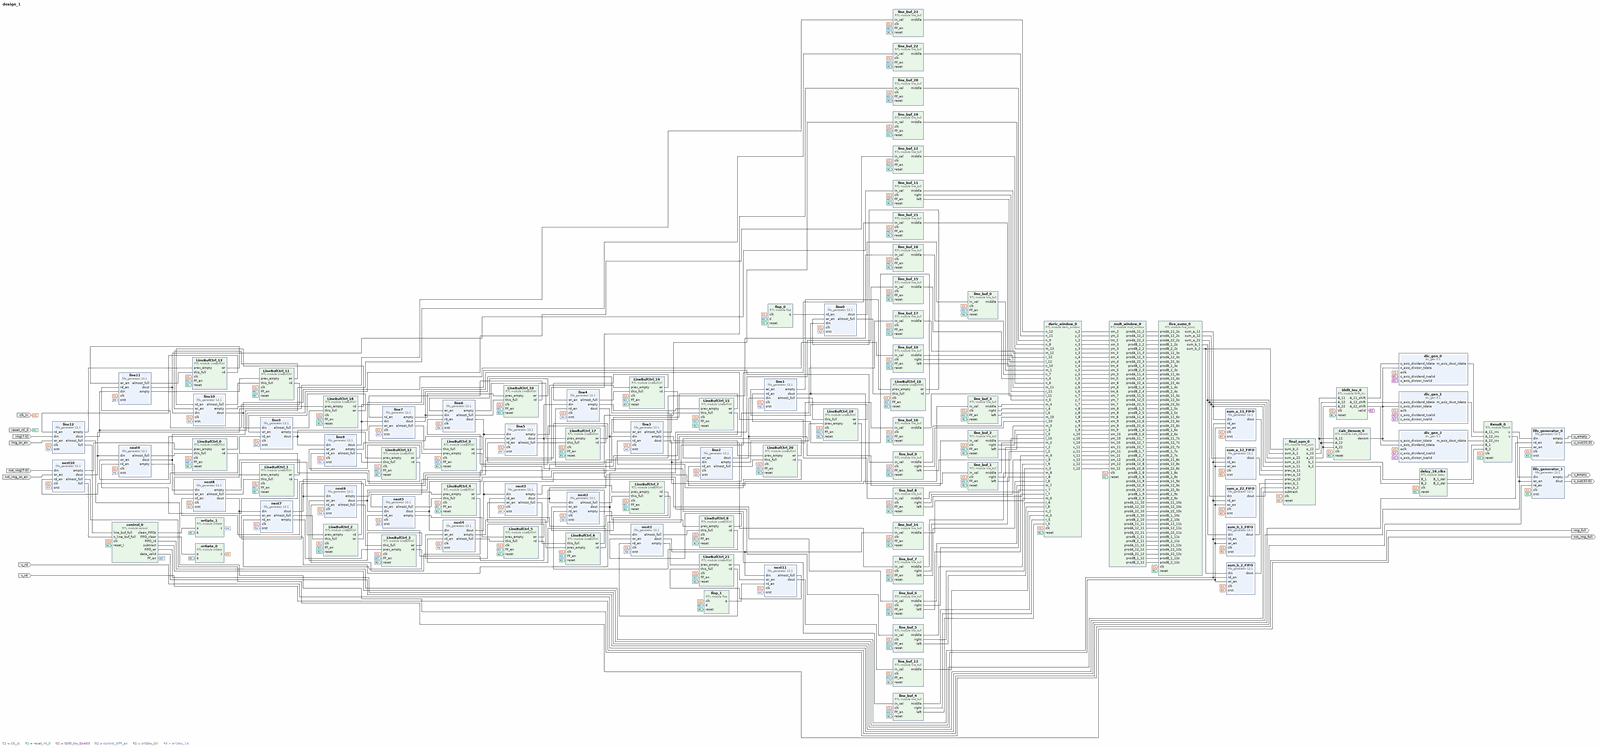
[diagram p0: block diagram of the top level, whole]
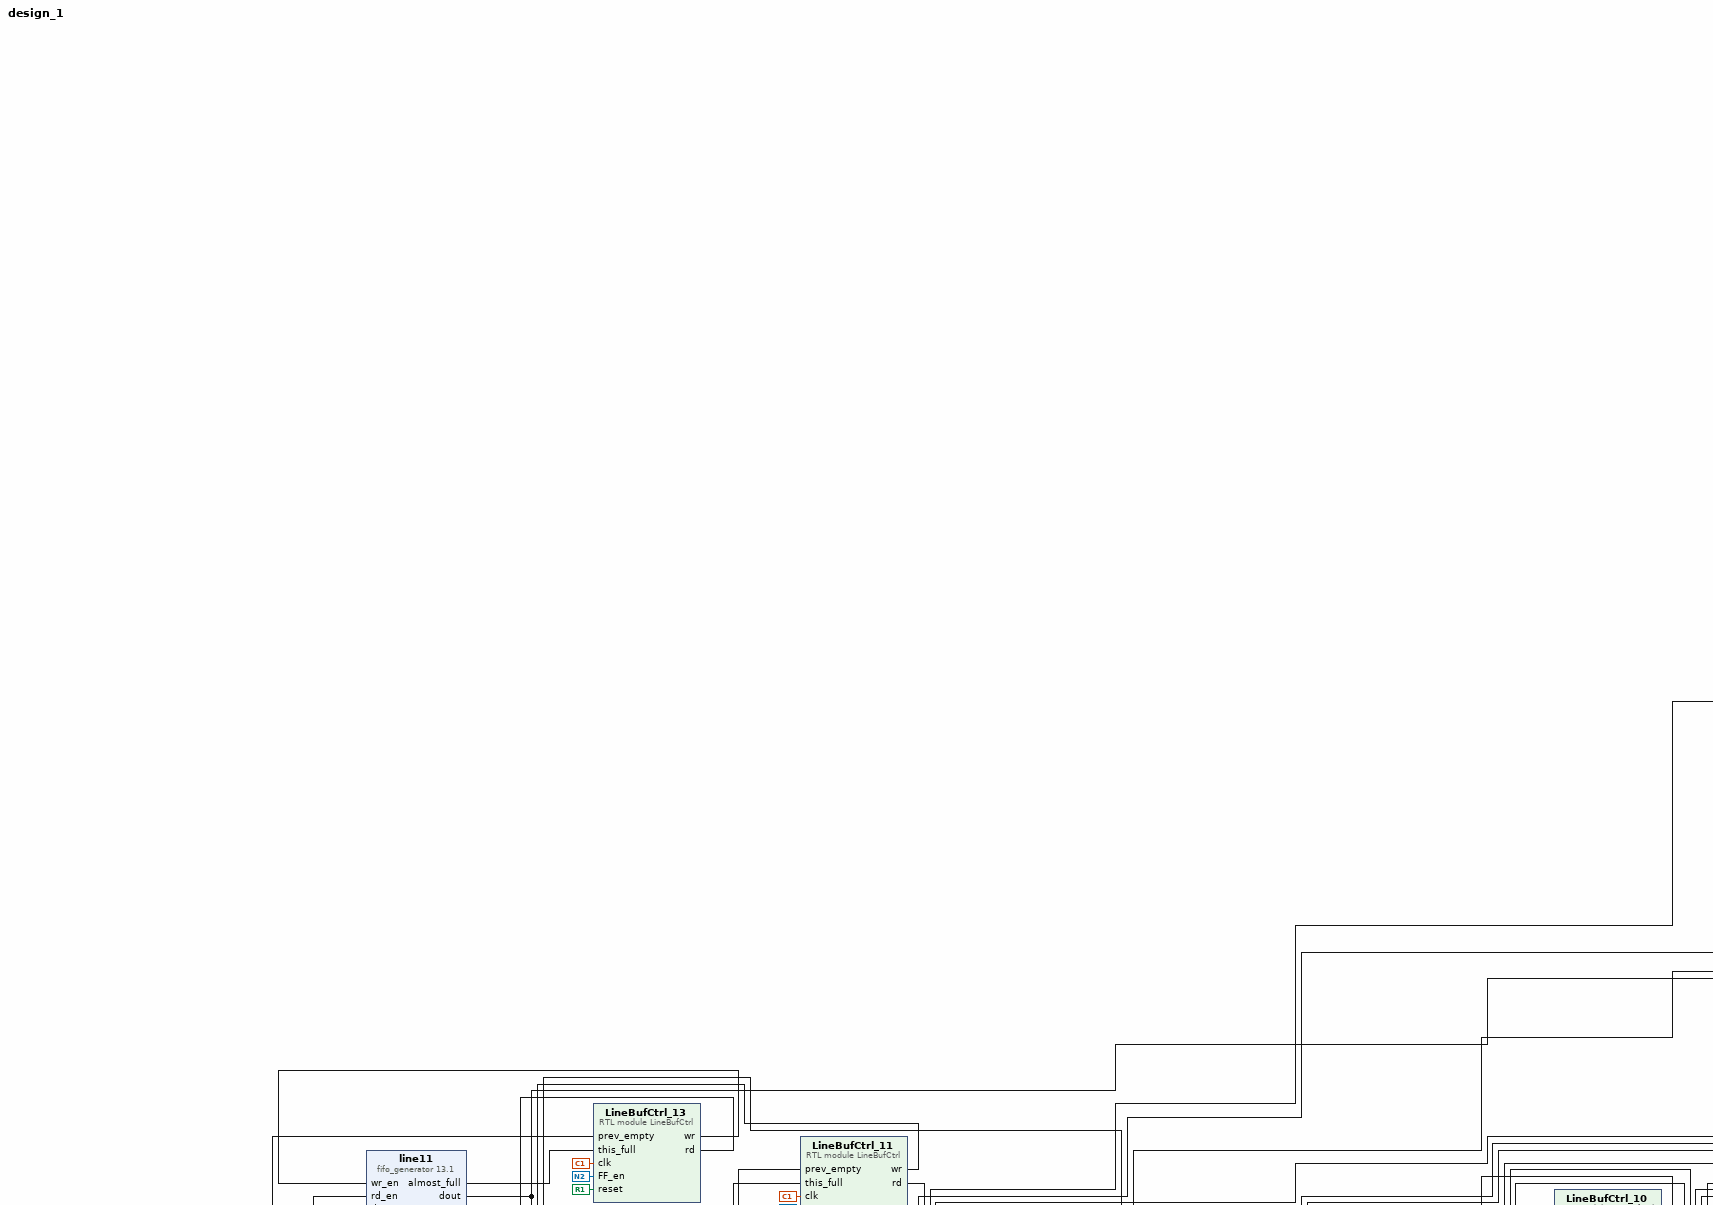
[diagram p1: block diagram of the top level, upper left part]
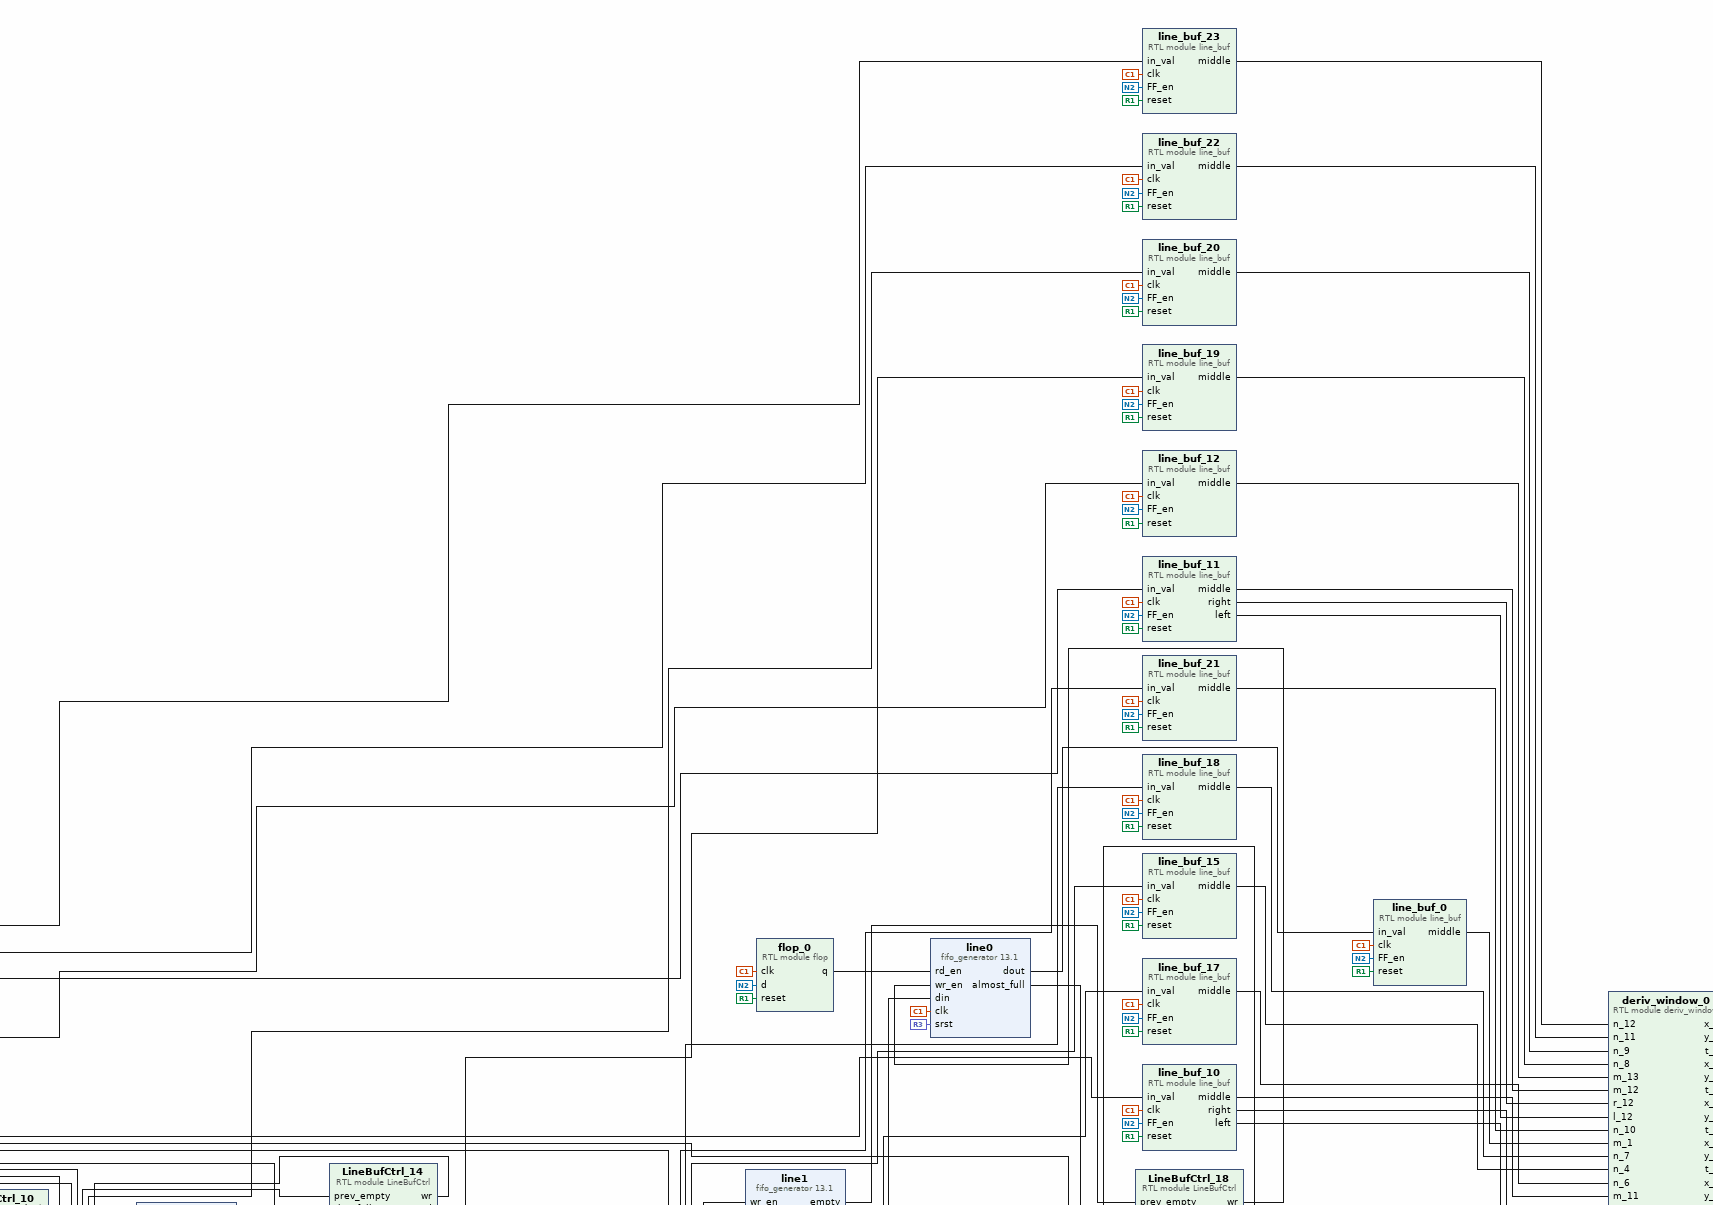
[diagram p2: block diagram of the top level, upper centre part]
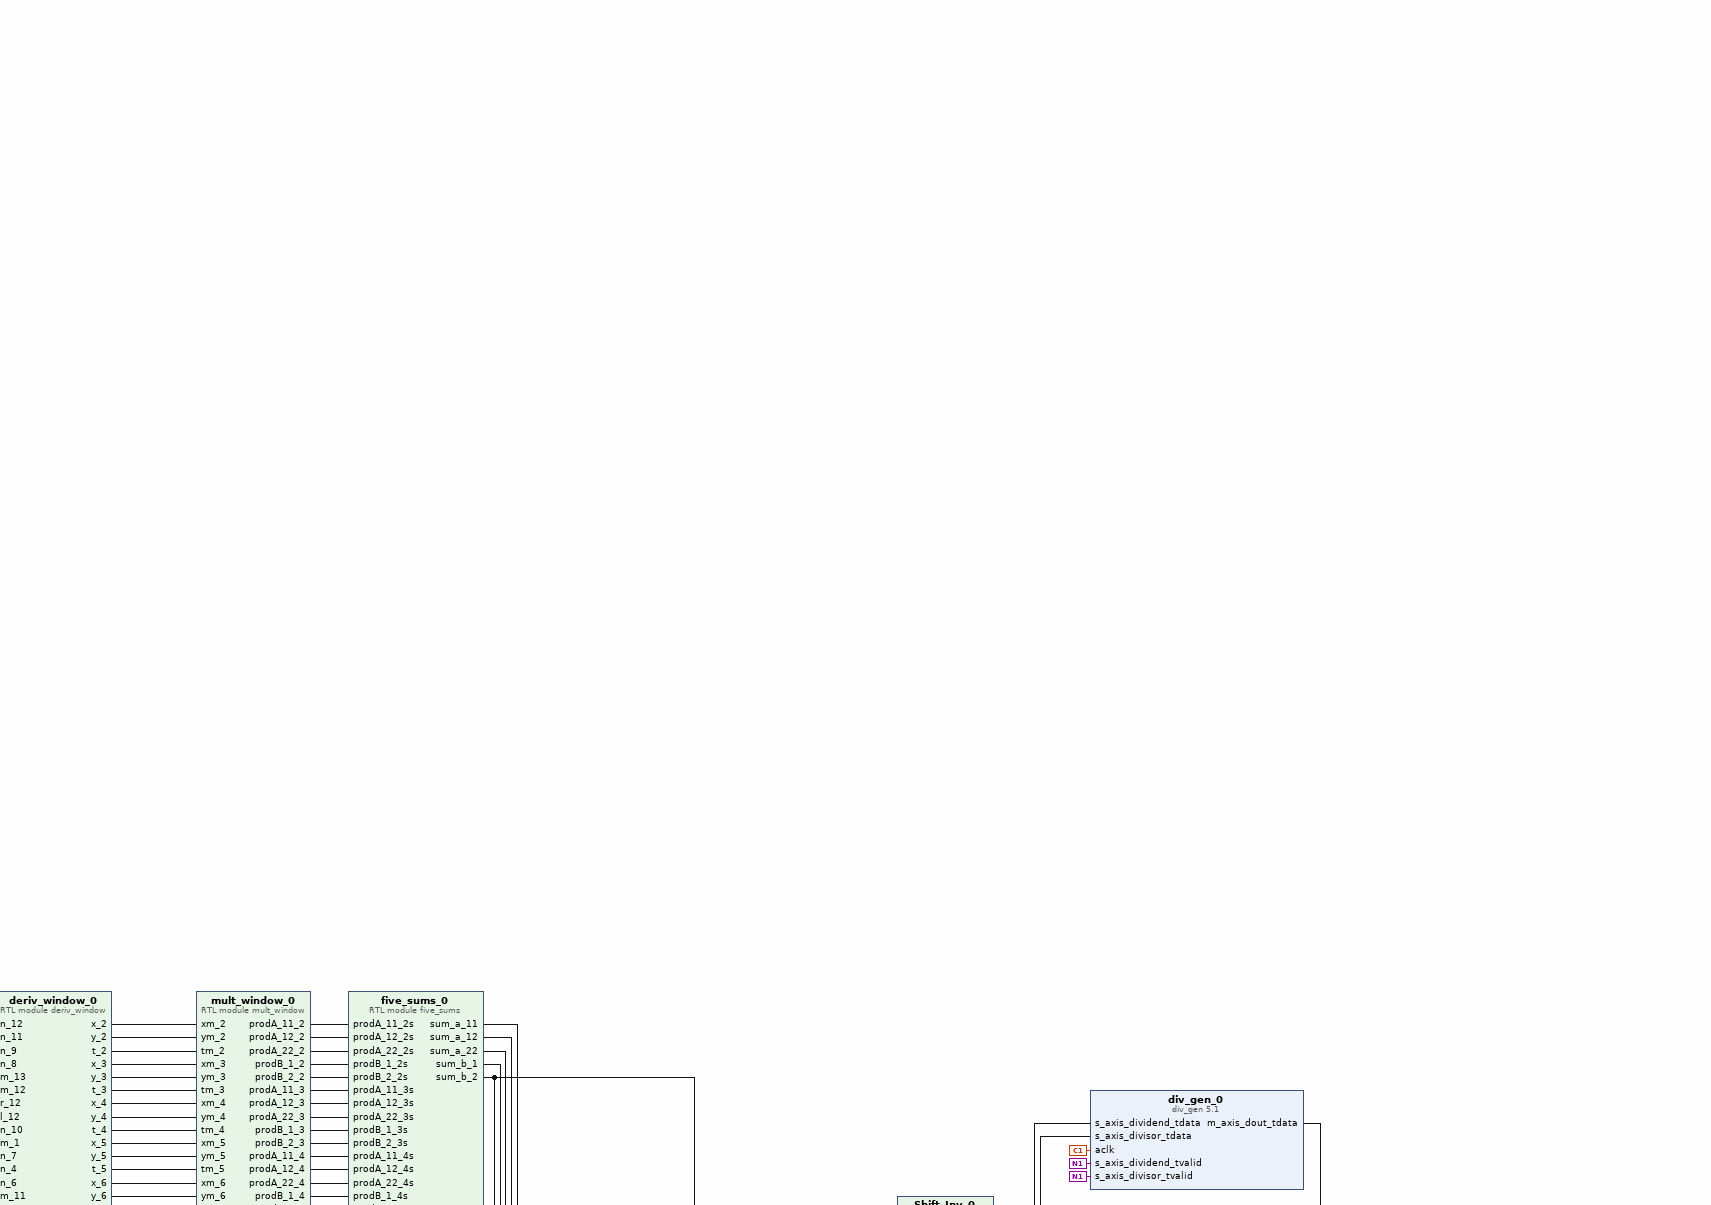
[diagram p3: block diagram of the top level, upper right part]
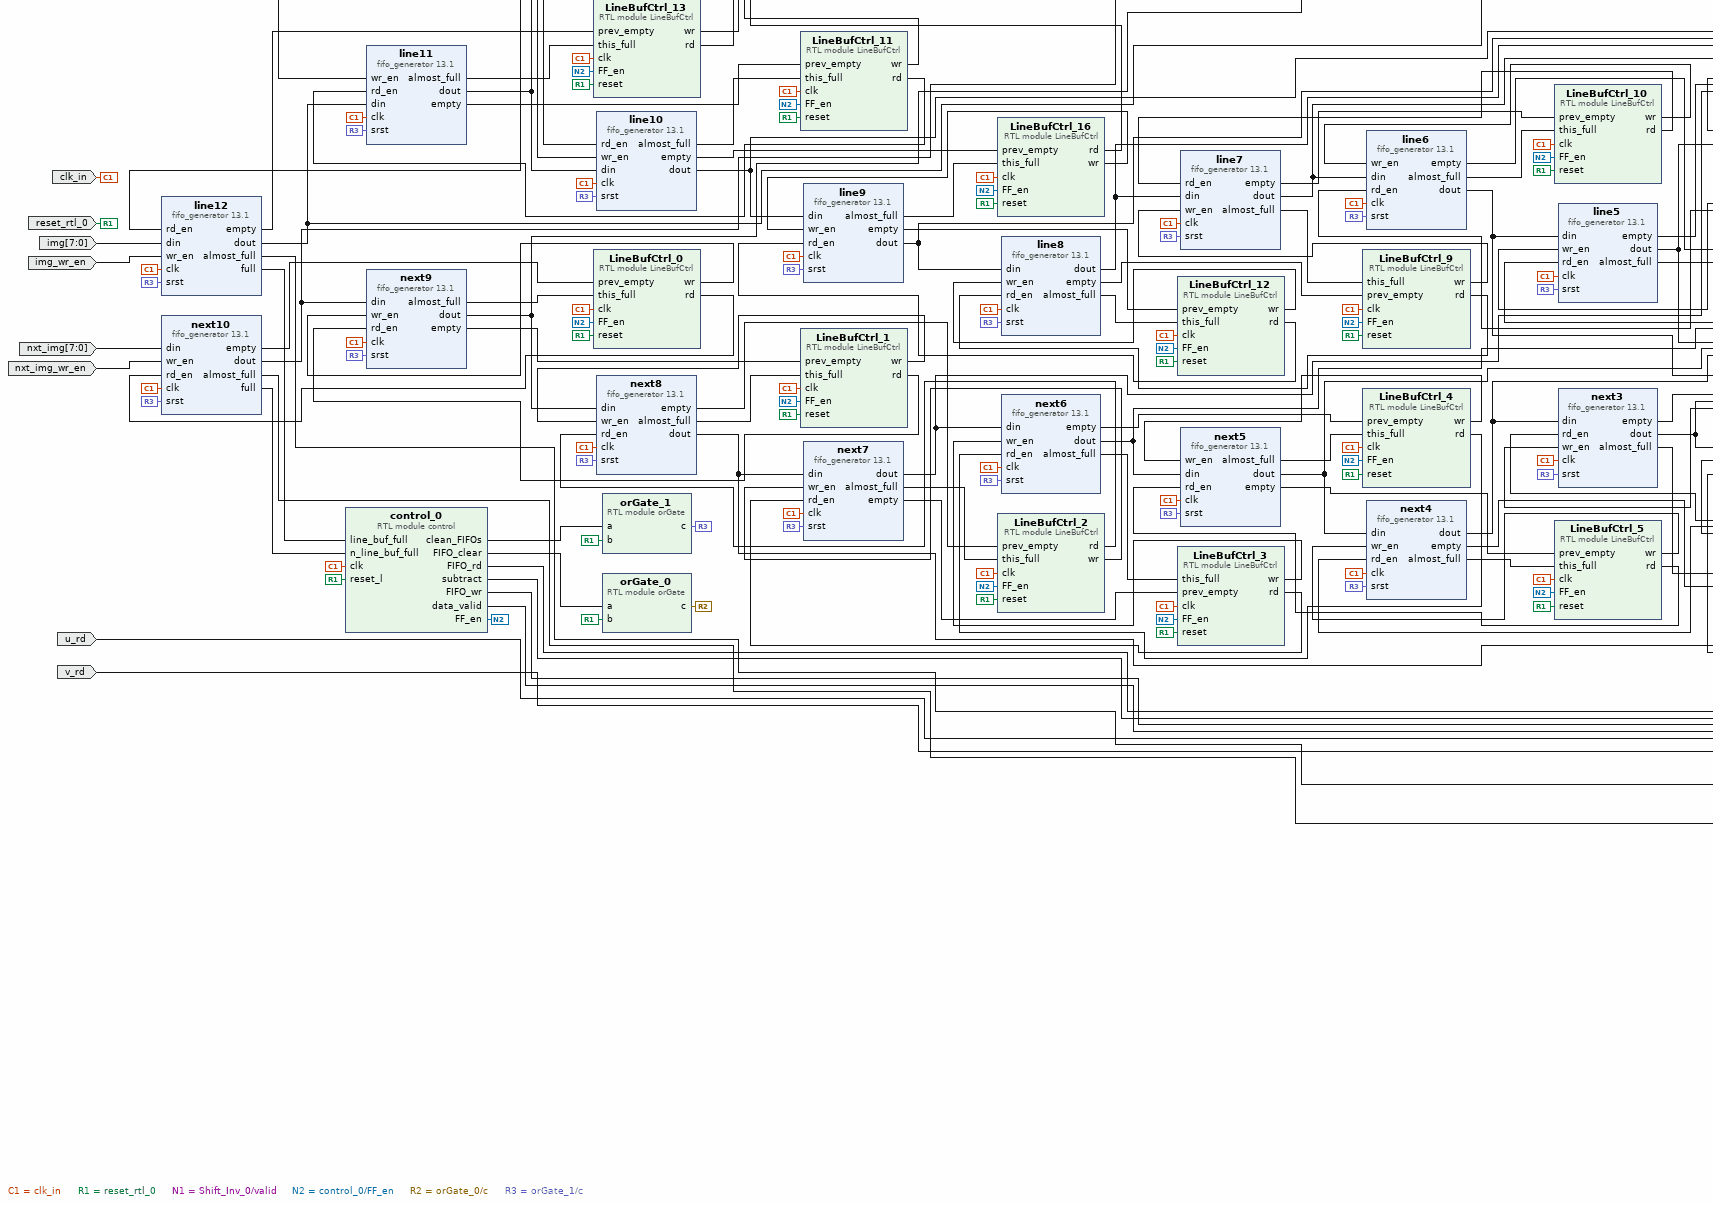
[diagram p4: block diagram of the top level, lower left part]
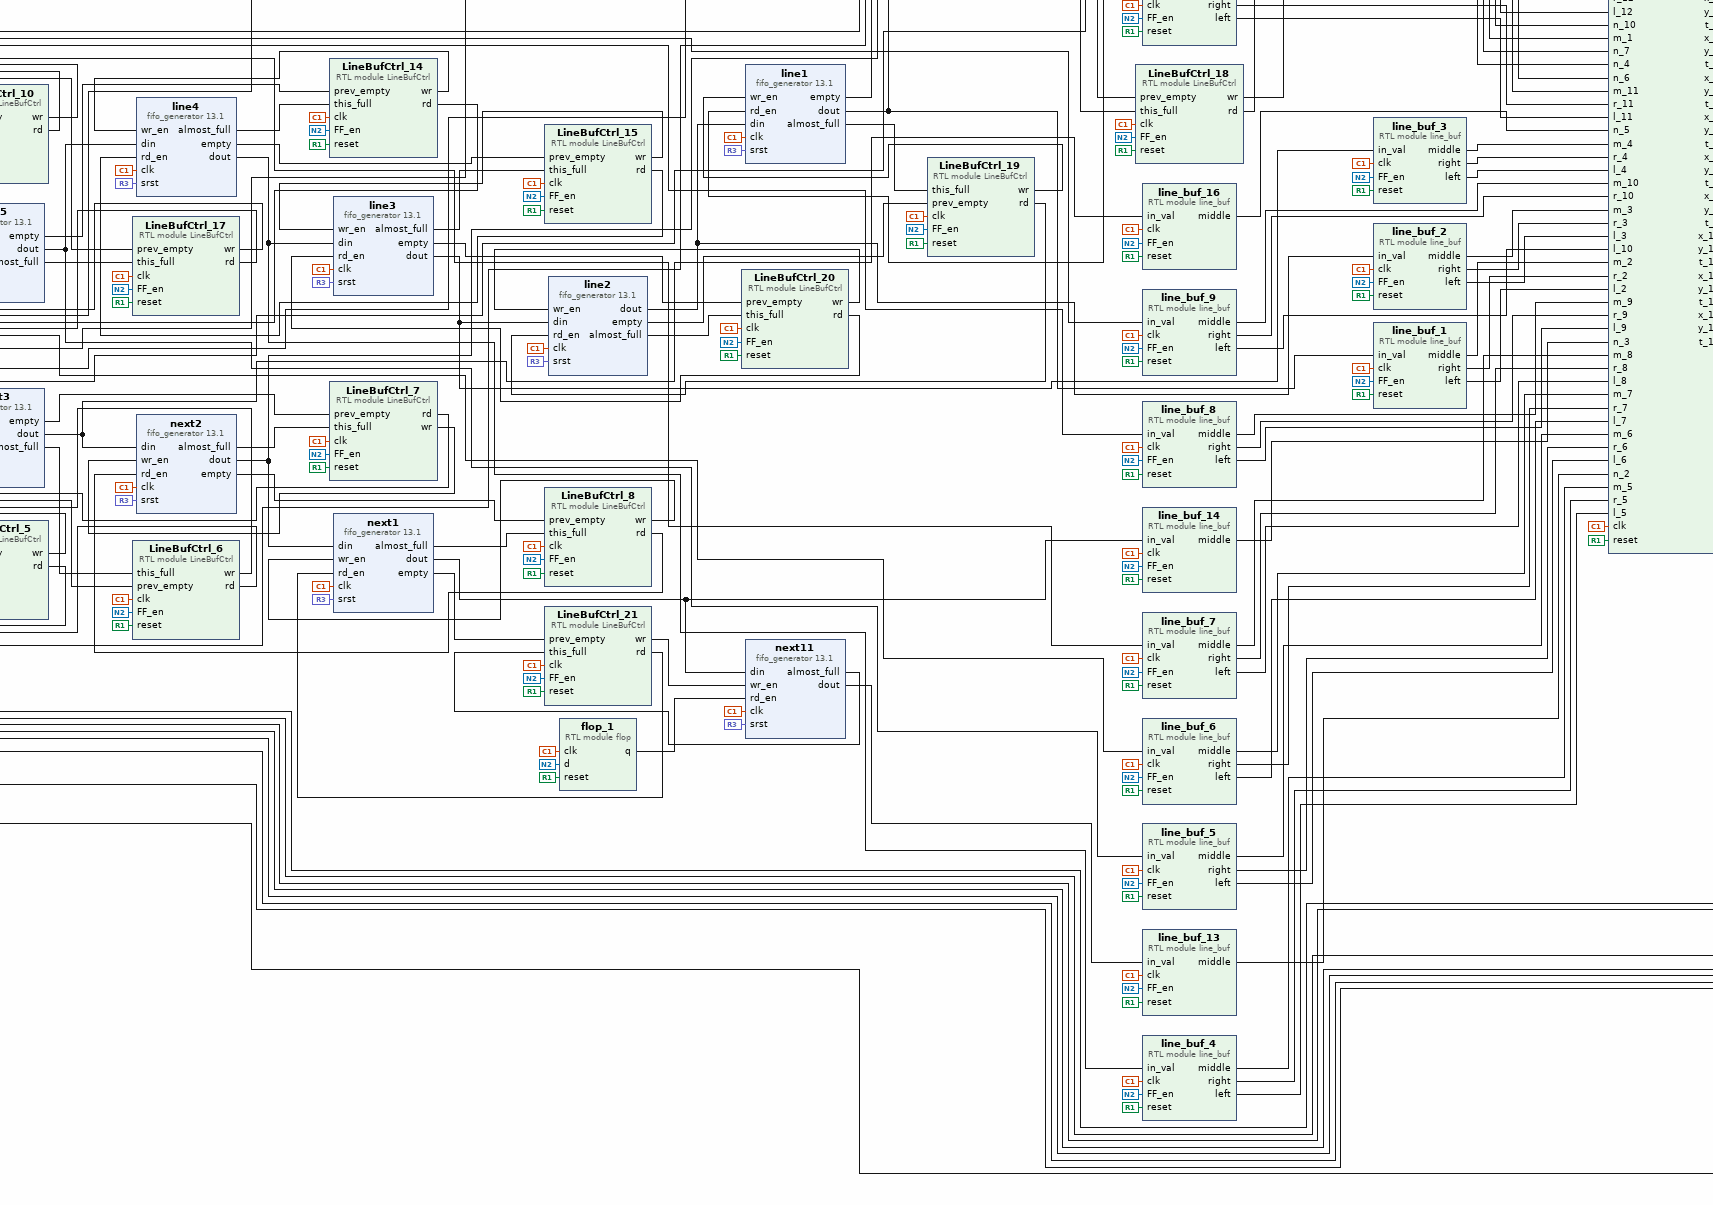
[diagram p5: block diagram of the top level, lower centre part]
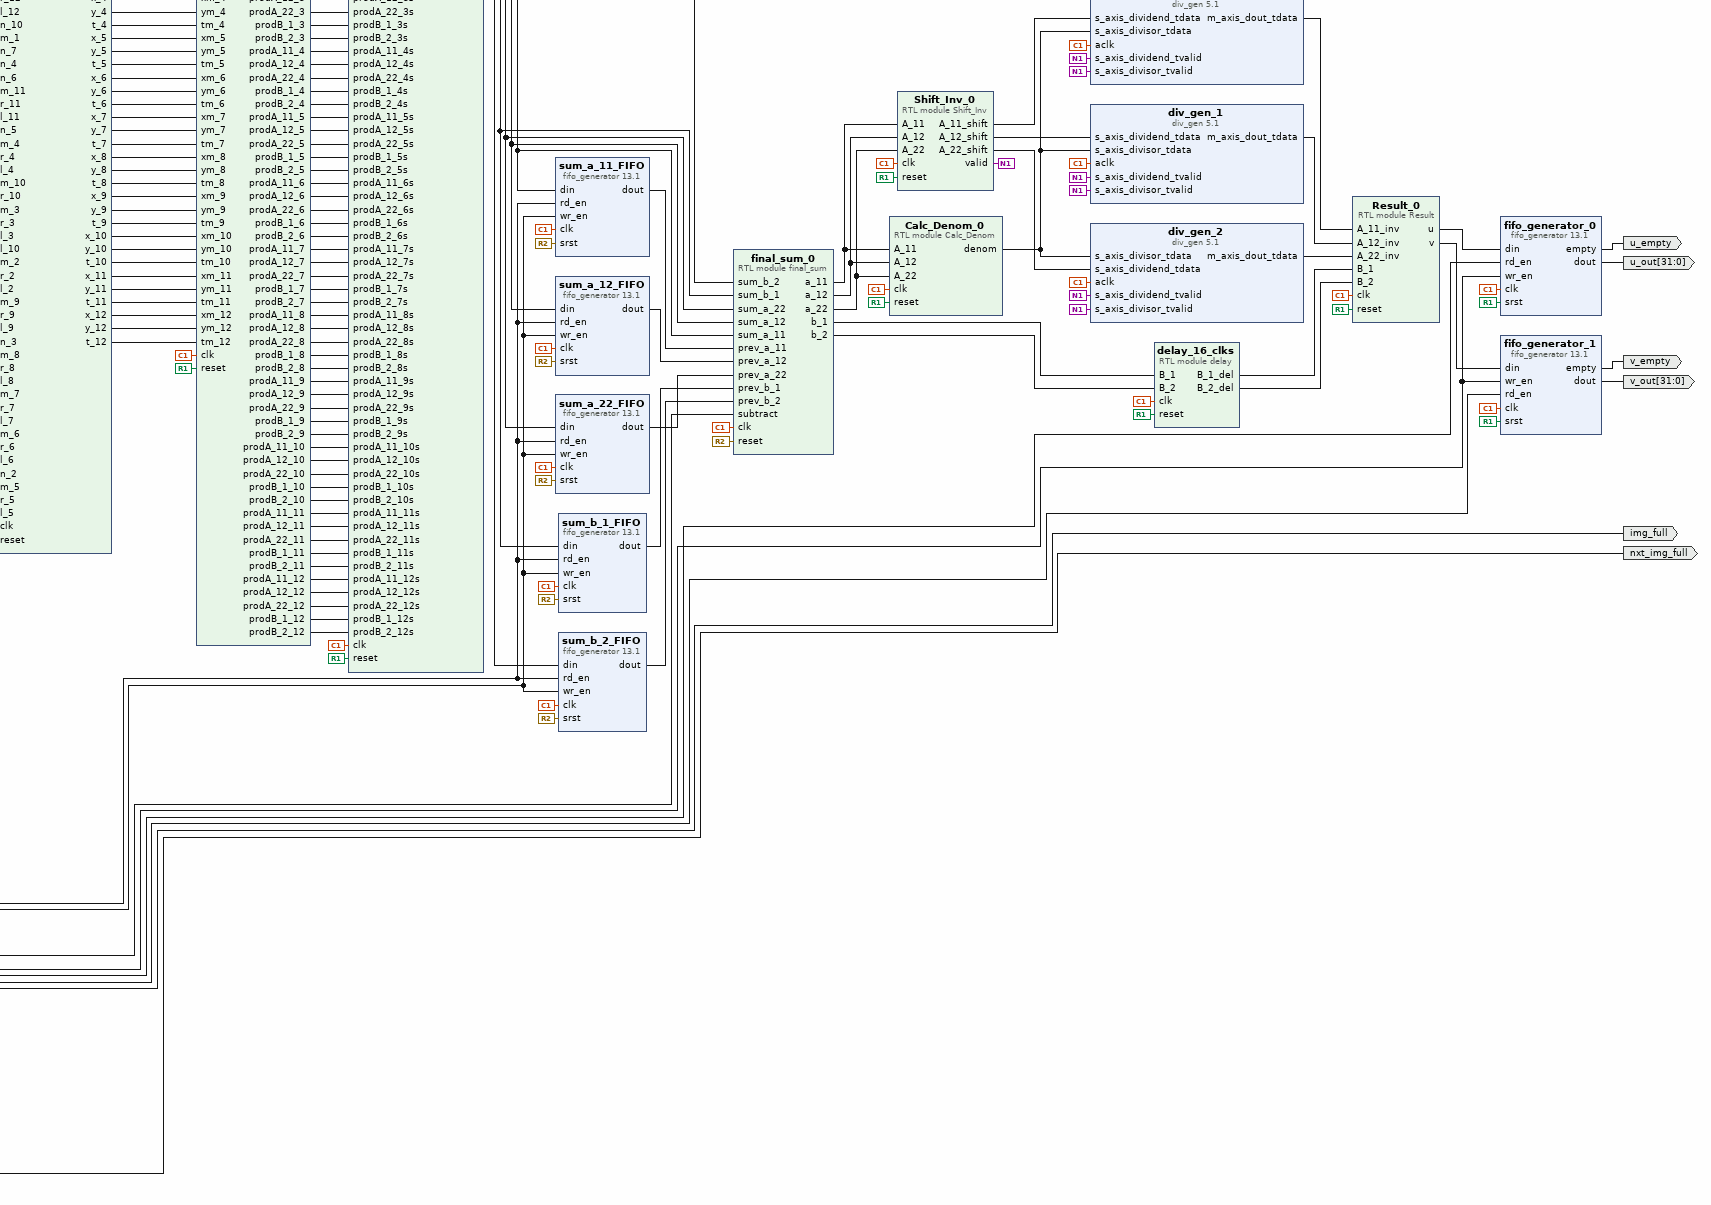
[diagram p6: block diagram of the top level, lower right part]
# Vivado block design design_1, xc7z020clg400-1, Vivado 2016.4
create_bd_design design_1

create_bd_port -dir I -type clk clk_in
set_property -dict {CONFIG.FREQ_HZ 100000000} [get_bd_ports clk_in]
create_bd_port -dir I -type rst reset_rtl_0
set_property -dict {CONFIG.POLARITY ACTIVE_LOW} [get_bd_ports reset_rtl_0]
create_bd_port -dir I -from 7 -to 0 -type data img
create_bd_port -dir I -from 7 -to 0 -type data nxt_img
create_bd_port -dir O u_empty
create_bd_port -dir O v_empty
create_bd_port -dir O -from 31 -to 0 -type data v_out
create_bd_port -dir O -from 31 -to 0 -type data u_out
create_bd_port -dir I u_rd
create_bd_port -dir I v_rd
create_bd_port -dir I nxt_img_wr_en
create_bd_port -dir I img_wr_en
create_bd_port -dir O img_full
create_bd_port -dir O nxt_img_full

create_bd_cell -type ip -vlnv xilinx.com:ip:fifo_generator:13.1 sum_a_22_FIFO
set_property -dict [list \
  CONFIG.INTERFACE_TYPE Native \
  CONFIG.Input_Data_Width 32 \
  CONFIG.Input_Depth 16 \
  CONFIG.Output_Data_Width 32 \
  CONFIG.Reset_Type Synchronous_Reset \
  CONFIG.TDATA_NUM_BYTES 32 \
  CONFIG.FIFO_Implementation_wach Common_Clock_Distributed_RAM \
  CONFIG.FIFO_Implementation_wrch Common_Clock_Distributed_RAM \
  CONFIG.FIFO_Implementation_rach Common_Clock_Distributed_RAM \
] [get_bd_cells sum_a_22_FIFO]
create_bd_cell -type ip -vlnv xilinx.com:ip:fifo_generator:13.1 sum_b_2_FIFO
set_property -dict [list \
  CONFIG.INTERFACE_TYPE Native \
  CONFIG.Input_Data_Width 32 \
  CONFIG.Input_Depth 16 \
  CONFIG.Output_Data_Width 32 \
  CONFIG.Reset_Type Synchronous_Reset \
  CONFIG.TDATA_NUM_BYTES 32 \
  CONFIG.FIFO_Implementation_wach Common_Clock_Distributed_RAM \
  CONFIG.FIFO_Implementation_wrch Common_Clock_Distributed_RAM \
  CONFIG.FIFO_Implementation_rach Common_Clock_Distributed_RAM \
] [get_bd_cells sum_b_2_FIFO]
create_bd_cell -type ip -vlnv xilinx.com:ip:fifo_generator:13.1 sum_b_1_FIFO
set_property -dict [list \
  CONFIG.INTERFACE_TYPE Native \
  CONFIG.Input_Data_Width 32 \
  CONFIG.Input_Depth 16 \
  CONFIG.Output_Data_Width 32 \
  CONFIG.Reset_Type Synchronous_Reset \
  CONFIG.TDATA_NUM_BYTES 32 \
  CONFIG.FIFO_Implementation_wach Common_Clock_Distributed_RAM \
  CONFIG.FIFO_Implementation_wrch Common_Clock_Distributed_RAM \
  CONFIG.FIFO_Implementation_rach Common_Clock_Distributed_RAM \
] [get_bd_cells sum_b_1_FIFO]
create_bd_cell -type ip -vlnv xilinx.com:ip:fifo_generator:13.1 sum_a_11_FIFO
set_property -dict [list \
  CONFIG.INTERFACE_TYPE Native \
  CONFIG.Input_Data_Width 32 \
  CONFIG.Input_Depth 16 \
  CONFIG.Output_Data_Width 32 \
  CONFIG.Reset_Type Synchronous_Reset \
  CONFIG.TDATA_NUM_BYTES 32 \
  CONFIG.FIFO_Implementation_wach Common_Clock_Distributed_RAM \
  CONFIG.FIFO_Implementation_wrch Common_Clock_Distributed_RAM \
  CONFIG.FIFO_Implementation_rach Common_Clock_Distributed_RAM \
] [get_bd_cells sum_a_11_FIFO]
create_bd_cell -type ip -vlnv xilinx.com:ip:fifo_generator:13.1 sum_a_12_FIFO
set_property -dict [list \
  CONFIG.INTERFACE_TYPE Native \
  CONFIG.Input_Data_Width 32 \
  CONFIG.Input_Depth 16 \
  CONFIG.Output_Data_Width 32 \
  CONFIG.Reset_Type Synchronous_Reset \
  CONFIG.TDATA_NUM_BYTES 32 \
  CONFIG.FIFO_Implementation_wach Common_Clock_Distributed_RAM \
  CONFIG.FIFO_Implementation_wrch Common_Clock_Distributed_RAM \
  CONFIG.FIFO_Implementation_rach Common_Clock_Distributed_RAM \
] [get_bd_cells sum_a_12_FIFO]
create_bd_cell -type ip -vlnv xilinx.com:ip:fifo_generator:13.1 line10
set_property -dict [list \
  CONFIG.Input_Data_Width 8 \
  CONFIG.Input_Depth 256 \
  CONFIG.Output_Data_Width 8 \
  CONFIG.Almost_Full_Flag true \
] [get_bd_cells line10]
create_bd_cell -type ip -vlnv xilinx.com:ip:fifo_generator:13.1 line9
set_property -dict [list \
  CONFIG.Input_Data_Width 8 \
  CONFIG.Input_Depth 256 \
  CONFIG.Output_Data_Width 8 \
  CONFIG.Almost_Full_Flag true \
] [get_bd_cells line9]
create_bd_cell -type ip -vlnv xilinx.com:ip:fifo_generator:13.1 line8
set_property -dict [list \
  CONFIG.Input_Data_Width 8 \
  CONFIG.Input_Depth 256 \
  CONFIG.Output_Data_Width 8 \
  CONFIG.Almost_Full_Flag true \
] [get_bd_cells line8]
create_bd_cell -type ip -vlnv xilinx.com:ip:fifo_generator:13.1 line4
set_property -dict [list \
  CONFIG.Input_Data_Width 8 \
  CONFIG.Input_Depth 256 \
  CONFIG.Output_Data_Width 8 \
  CONFIG.Almost_Full_Flag true \
] [get_bd_cells line4]
create_bd_cell -type ip -vlnv xilinx.com:ip:fifo_generator:13.1 line7
set_property -dict [list \
  CONFIG.Input_Data_Width 8 \
  CONFIG.Input_Depth 256 \
  CONFIG.Output_Data_Width 8 \
  CONFIG.Almost_Full_Flag true \
] [get_bd_cells line7]
create_bd_cell -type ip -vlnv xilinx.com:ip:fifo_generator:13.1 line12
set_property -dict [list \
  CONFIG.Input_Data_Width 8 \
  CONFIG.Input_Depth 256 \
  CONFIG.Output_Data_Width 8 \
  CONFIG.Use_Dout_Reset true \
  CONFIG.Dout_Reset_Value 0 \
  CONFIG.Almost_Full_Flag true \
  CONFIG.Programmable_Full_Type No_Programmable_Full_Threshold \
] [get_bd_cells line12]
create_bd_cell -type ip -vlnv xilinx.com:ip:fifo_generator:13.1 line1
set_property -dict [list \
  CONFIG.Input_Data_Width 8 \
  CONFIG.Input_Depth 256 \
  CONFIG.Output_Data_Width 8 \
  CONFIG.Almost_Full_Flag true \
] [get_bd_cells line1]
create_bd_cell -type ip -vlnv xilinx.com:ip:fifo_generator:13.1 line2
set_property -dict [list \
  CONFIG.Input_Data_Width 8 \
  CONFIG.Input_Depth 256 \
  CONFIG.Output_Data_Width 8 \
  CONFIG.Almost_Full_Flag true \
] [get_bd_cells line2]
create_bd_cell -type ip -vlnv xilinx.com:ip:fifo_generator:13.1 line3
set_property -dict [list \
  CONFIG.Input_Data_Width 8 \
  CONFIG.Input_Depth 256 \
  CONFIG.Output_Data_Width 8 \
  CONFIG.Almost_Full_Flag true \
] [get_bd_cells line3]
create_bd_cell -type ip -vlnv xilinx.com:ip:fifo_generator:13.1 line11
set_property -dict [list \
  CONFIG.Input_Data_Width 8 \
  CONFIG.Input_Depth 256 \
  CONFIG.Output_Data_Width 8 \
  CONFIG.Almost_Full_Flag true \
] [get_bd_cells line11]
create_bd_cell -type ip -vlnv xilinx.com:ip:fifo_generator:13.1 line5
set_property -dict [list \
  CONFIG.Input_Data_Width 8 \
  CONFIG.Input_Depth 256 \
  CONFIG.Output_Data_Width 8 \
  CONFIG.Almost_Full_Flag true \
] [get_bd_cells line5]
create_bd_cell -type ip -vlnv xilinx.com:ip:fifo_generator:13.1 line6
set_property -dict [list \
  CONFIG.Input_Data_Width 8 \
  CONFIG.Input_Depth 256 \
  CONFIG.Output_Data_Width 8 \
  CONFIG.Almost_Full_Flag true \
] [get_bd_cells line6]
create_bd_cell -type ip -vlnv xilinx.com:ip:fifo_generator:13.1 line0
set_property -dict [list \
  CONFIG.Input_Data_Width 8 \
  CONFIG.Input_Depth 256 \
  CONFIG.Output_Data_Width 8 \
  CONFIG.Almost_Full_Flag true \
] [get_bd_cells line0]
create_bd_cell -type ip -vlnv xilinx.com:ip:fifo_generator:13.1 next10
set_property -dict [list \
  CONFIG.Input_Data_Width 8 \
  CONFIG.Input_Depth 256 \
  CONFIG.Output_Data_Width 8 \
  CONFIG.Almost_Full_Flag true \
] [get_bd_cells next10]
create_bd_cell -type ip -vlnv xilinx.com:ip:fifo_generator:13.1 next9
set_property -dict [list \
  CONFIG.Input_Data_Width 8 \
  CONFIG.Input_Depth 256 \
  CONFIG.Output_Data_Width 8 \
  CONFIG.Almost_Full_Flag true \
] [get_bd_cells next9]
create_bd_cell -type ip -vlnv xilinx.com:ip:fifo_generator:13.1 next8
set_property -dict [list \
  CONFIG.Input_Data_Width 8 \
  CONFIG.Input_Depth 256 \
  CONFIG.Output_Data_Width 8 \
  CONFIG.Almost_Full_Flag true \
] [get_bd_cells next8]
create_bd_cell -type ip -vlnv xilinx.com:ip:fifo_generator:13.1 next7
set_property -dict [list \
  CONFIG.Input_Data_Width 8 \
  CONFIG.Input_Depth 256 \
  CONFIG.Output_Data_Width 8 \
  CONFIG.Almost_Full_Flag true \
] [get_bd_cells next7]
create_bd_cell -type ip -vlnv xilinx.com:ip:fifo_generator:13.1 next1
set_property -dict [list \
  CONFIG.Input_Data_Width 8 \
  CONFIG.Input_Depth 256 \
  CONFIG.Output_Data_Width 8 \
  CONFIG.Almost_Full_Flag true \
] [get_bd_cells next1]
create_bd_cell -type ip -vlnv xilinx.com:ip:fifo_generator:13.1 next2
set_property -dict [list \
  CONFIG.Input_Data_Width 8 \
  CONFIG.Input_Depth 256 \
  CONFIG.Output_Data_Width 8 \
  CONFIG.Almost_Full_Flag true \
] [get_bd_cells next2]
create_bd_cell -type ip -vlnv xilinx.com:ip:fifo_generator:13.1 next3
set_property -dict [list \
  CONFIG.Input_Data_Width 8 \
  CONFIG.Input_Depth 256 \
  CONFIG.Output_Data_Width 8 \
  CONFIG.Almost_Full_Flag true \
] [get_bd_cells next3]
create_bd_cell -type ip -vlnv xilinx.com:ip:fifo_generator:13.1 next6
set_property -dict [list \
  CONFIG.Input_Data_Width 8 \
  CONFIG.Input_Depth 256 \
  CONFIG.Output_Data_Width 8 \
  CONFIG.Almost_Full_Flag true \
] [get_bd_cells next6]
create_bd_cell -type ip -vlnv xilinx.com:ip:fifo_generator:13.1 next4
set_property -dict [list \
  CONFIG.Input_Data_Width 8 \
  CONFIG.Input_Depth 256 \
  CONFIG.Output_Data_Width 8 \
  CONFIG.Almost_Full_Flag true \
] [get_bd_cells next4]
create_bd_cell -type ip -vlnv xilinx.com:ip:fifo_generator:13.1 next5
set_property -dict [list \
  CONFIG.Input_Data_Width 8 \
  CONFIG.Input_Depth 256 \
  CONFIG.Output_Data_Width 8 \
  CONFIG.Almost_Full_Flag true \
] [get_bd_cells next5]
create_bd_cell -type ip -vlnv xilinx.com:ip:div_gen:5.1 div_gen_0
set_property -dict [list \
  CONFIG.algorithm_type Radix2 \
  CONFIG.dividend_and_quotient_width 32 \
  CONFIG.divisor_width 32 \
  CONFIG.remainder_type Fractional \
  CONFIG.fractional_width 2 \
  CONFIG.latency_configuration Manual \
  CONFIG.latency 18 \
] [get_bd_cells div_gen_0]
create_bd_cell -type ip -vlnv xilinx.com:ip:div_gen:5.1 div_gen_1
set_property -dict [list \
  CONFIG.algorithm_type Radix2 \
  CONFIG.dividend_and_quotient_width 32 \
  CONFIG.divisor_width 32 \
  CONFIG.remainder_type Fractional \
  CONFIG.fractional_width 2 \
  CONFIG.latency_configuration Manual \
  CONFIG.latency 18 \
] [get_bd_cells div_gen_1]
create_bd_cell -type ip -vlnv xilinx.com:ip:div_gen:5.1 div_gen_2
set_property -dict [list \
  CONFIG.algorithm_type Radix2 \
  CONFIG.dividend_and_quotient_width 32 \
  CONFIG.divisor_width 32 \
  CONFIG.remainder_type Fractional \
  CONFIG.fractional_width 2 \
  CONFIG.divide_by_zero_detect false \
  CONFIG.FlowControl NonBlocking \
  CONFIG.latency_configuration Manual \
  CONFIG.latency 18 \
] [get_bd_cells div_gen_2]
create_bd_cell -type ip -vlnv xilinx.com:ip:fifo_generator:13.1 next11
set_property -dict [list \
  CONFIG.Input_Data_Width 8 \
  CONFIG.Input_Depth 256 \
  CONFIG.Output_Data_Width 8 \
  CONFIG.Almost_Full_Flag true \
] [get_bd_cells next11]
create_bd_cell -type ip -vlnv xilinx.com:ip:fifo_generator:13.1 fifo_generator_0
set_property -dict {CONFIG.Input_Data_Width 32 CONFIG.Input_Depth 16 CONFIG.Output_Data_Width 32} [get_bd_cells fifo_generator_0]
create_bd_cell -type ip -vlnv xilinx.com:ip:fifo_generator:13.1 fifo_generator_1
set_property -dict {CONFIG.Input_Data_Width 32 CONFIG.Input_Depth 16 CONFIG.Output_Data_Width 32} [get_bd_cells fifo_generator_1]
create_bd_cell -type module -reference line_buf line_buf_0
create_bd_cell -type module -reference line_buf line_buf_1
create_bd_cell -type module -reference line_buf line_buf_2
create_bd_cell -type module -reference line_buf line_buf_3
create_bd_cell -type module -reference line_buf line_buf_4
create_bd_cell -type module -reference line_buf line_buf_5
create_bd_cell -type module -reference line_buf line_buf_6
create_bd_cell -type module -reference line_buf line_buf_12
create_bd_cell -type module -reference line_buf line_buf_7
create_bd_cell -type module -reference line_buf line_buf_8
create_bd_cell -type module -reference line_buf line_buf_9
create_bd_cell -type module -reference line_buf line_buf_10
create_bd_cell -type module -reference line_buf line_buf_11
create_bd_cell -type module -reference line_buf line_buf_13
create_bd_cell -type module -reference line_buf line_buf_14
create_bd_cell -type module -reference line_buf line_buf_23
create_bd_cell -type module -reference line_buf line_buf_15
create_bd_cell -type module -reference line_buf line_buf_16
create_bd_cell -type module -reference line_buf line_buf_17
create_bd_cell -type module -reference line_buf line_buf_18
create_bd_cell -type module -reference line_buf line_buf_19
create_bd_cell -type module -reference line_buf line_buf_20
create_bd_cell -type module -reference line_buf line_buf_21
create_bd_cell -type module -reference line_buf line_buf_22
create_bd_cell -type module -reference mult_window mult_window_0
create_bd_cell -type module -reference final_sum final_sum_0
create_bd_cell -type module -reference delay delay_16_clks
create_bd_cell -type module -reference Shift_Inv Shift_Inv_0
create_bd_cell -type module -reference orGate orGate_0
create_bd_cell -type module -reference orGate orGate_1
create_bd_cell -type module -reference Calc_Denom Calc_Denom_0
create_bd_cell -type module -reference LineBufCtrl LineBufCtrl_0
create_bd_cell -type module -reference LineBufCtrl LineBufCtrl_1
create_bd_cell -type module -reference LineBufCtrl LineBufCtrl_2
create_bd_cell -type module -reference LineBufCtrl LineBufCtrl_3
create_bd_cell -type module -reference LineBufCtrl LineBufCtrl_4
create_bd_cell -type module -reference LineBufCtrl LineBufCtrl_5
create_bd_cell -type module -reference LineBufCtrl LineBufCtrl_6
create_bd_cell -type module -reference LineBufCtrl LineBufCtrl_7
create_bd_cell -type module -reference LineBufCtrl LineBufCtrl_8
create_bd_cell -type module -reference LineBufCtrl LineBufCtrl_9
create_bd_cell -type module -reference LineBufCtrl LineBufCtrl_18
create_bd_cell -type module -reference LineBufCtrl LineBufCtrl_19
create_bd_cell -type module -reference LineBufCtrl LineBufCtrl_20
create_bd_cell -type module -reference LineBufCtrl LineBufCtrl_10
create_bd_cell -type module -reference LineBufCtrl LineBufCtrl_11
create_bd_cell -type module -reference LineBufCtrl LineBufCtrl_12
create_bd_cell -type module -reference LineBufCtrl LineBufCtrl_13
create_bd_cell -type module -reference LineBufCtrl LineBufCtrl_14
create_bd_cell -type module -reference LineBufCtrl LineBufCtrl_15
create_bd_cell -type module -reference LineBufCtrl LineBufCtrl_16
create_bd_cell -type module -reference LineBufCtrl LineBufCtrl_17
create_bd_cell -type module -reference LineBufCtrl LineBufCtrl_21
create_bd_cell -type module -reference flop flop_0
create_bd_cell -type module -reference flop flop_1
create_bd_cell -type module -reference deriv_window deriv_window_0
create_bd_cell -type module -reference five_sums five_sums_0
create_bd_cell -type module -reference Result Result_0
create_bd_cell -type module -reference control control_0

# ---- connections ----

connect_bd_net [get_bd_pins deriv_window_0/x_2] [get_bd_pins mult_window_0/xm_2]
connect_bd_net [get_bd_pins deriv_window_0/y_2] [get_bd_pins mult_window_0/ym_2]
connect_bd_net [get_bd_pins deriv_window_0/t_2] [get_bd_pins mult_window_0/tm_2]
connect_bd_net [get_bd_pins deriv_window_0/x_3] [get_bd_pins mult_window_0/xm_3]
connect_bd_net [get_bd_pins deriv_window_0/y_3] [get_bd_pins mult_window_0/ym_3]
connect_bd_net [get_bd_pins deriv_window_0/t_3] [get_bd_pins mult_window_0/tm_3]
connect_bd_net [get_bd_pins deriv_window_0/x_4] [get_bd_pins mult_window_0/xm_4]
connect_bd_net [get_bd_pins deriv_window_0/y_4] [get_bd_pins mult_window_0/ym_4]
connect_bd_net [get_bd_pins deriv_window_0/t_4] [get_bd_pins mult_window_0/tm_4]
connect_bd_net [get_bd_pins deriv_window_0/x_5] [get_bd_pins mult_window_0/xm_5]
connect_bd_net [get_bd_pins deriv_window_0/y_5] [get_bd_pins mult_window_0/ym_5]
connect_bd_net [get_bd_pins deriv_window_0/t_5] [get_bd_pins mult_window_0/tm_5]
connect_bd_net [get_bd_pins deriv_window_0/x_6] [get_bd_pins mult_window_0/xm_6]
connect_bd_net [get_bd_pins deriv_window_0/y_6] [get_bd_pins mult_window_0/ym_6]
connect_bd_net [get_bd_pins deriv_window_0/t_6] [get_bd_pins mult_window_0/tm_6]
connect_bd_net [get_bd_pins deriv_window_0/x_7] [get_bd_pins mult_window_0/xm_7]
connect_bd_net [get_bd_pins deriv_window_0/y_7] [get_bd_pins mult_window_0/ym_7]
connect_bd_net [get_bd_pins deriv_window_0/t_7] [get_bd_pins mult_window_0/tm_7]
connect_bd_net [get_bd_pins deriv_window_0/x_8] [get_bd_pins mult_window_0/xm_8]
connect_bd_net [get_bd_pins deriv_window_0/y_8] [get_bd_pins mult_window_0/ym_8]
connect_bd_net [get_bd_pins deriv_window_0/t_8] [get_bd_pins mult_window_0/tm_8]
connect_bd_net [get_bd_pins deriv_window_0/x_9] [get_bd_pins mult_window_0/xm_9]
connect_bd_net [get_bd_pins deriv_window_0/y_9] [get_bd_pins mult_window_0/ym_9]
connect_bd_net [get_bd_pins deriv_window_0/t_9] [get_bd_pins mult_window_0/tm_9]
connect_bd_net [get_bd_pins deriv_window_0/x_10] [get_bd_pins mult_window_0/xm_10]
connect_bd_net [get_bd_pins deriv_window_0/y_10] [get_bd_pins mult_window_0/ym_10]
connect_bd_net [get_bd_pins deriv_window_0/t_10] [get_bd_pins mult_window_0/tm_10]
connect_bd_net [get_bd_pins deriv_window_0/x_11] [get_bd_pins mult_window_0/xm_11]
connect_bd_net [get_bd_pins deriv_window_0/y_11] [get_bd_pins mult_window_0/ym_11]
connect_bd_net [get_bd_pins deriv_window_0/t_11] [get_bd_pins mult_window_0/tm_11]
connect_bd_net [get_bd_pins deriv_window_0/x_12] [get_bd_pins mult_window_0/xm_12]
connect_bd_net [get_bd_pins deriv_window_0/y_12] [get_bd_pins mult_window_0/ym_12]
connect_bd_net [get_bd_pins deriv_window_0/t_12] [get_bd_pins mult_window_0/tm_12]
connect_bd_net [get_bd_pins mult_window_0/prodA_11_2] [get_bd_pins five_sums_0/prodA_11_2s]
connect_bd_net [get_bd_pins mult_window_0/prodA_12_2] [get_bd_pins five_sums_0/prodA_12_2s]
connect_bd_net [get_bd_pins mult_window_0/prodA_22_2] [get_bd_pins five_sums_0/prodA_22_2s]
connect_bd_net [get_bd_pins mult_window_0/prodB_1_2] [get_bd_pins five_sums_0/prodB_1_2s]
connect_bd_net [get_bd_pins mult_window_0/prodB_2_2] [get_bd_pins five_sums_0/prodB_2_2s]
connect_bd_net [get_bd_pins mult_window_0/prodA_11_3] [get_bd_pins five_sums_0/prodA_11_3s]
connect_bd_net [get_bd_pins mult_window_0/prodA_12_3] [get_bd_pins five_sums_0/prodA_12_3s]
connect_bd_net [get_bd_pins mult_window_0/prodA_22_3] [get_bd_pins five_sums_0/prodA_22_3s]
connect_bd_net [get_bd_pins mult_window_0/prodB_1_3] [get_bd_pins five_sums_0/prodB_1_3s]
connect_bd_net [get_bd_pins mult_window_0/prodB_2_3] [get_bd_pins five_sums_0/prodB_2_3s]
connect_bd_net [get_bd_pins mult_window_0/prodA_11_4] [get_bd_pins five_sums_0/prodA_11_4s]
connect_bd_net [get_bd_pins mult_window_0/prodA_12_4] [get_bd_pins five_sums_0/prodA_12_4s]
connect_bd_net [get_bd_pins mult_window_0/prodA_22_4] [get_bd_pins five_sums_0/prodA_22_4s]
connect_bd_net [get_bd_pins mult_window_0/prodB_1_4] [get_bd_pins five_sums_0/prodB_1_4s]
connect_bd_net [get_bd_pins mult_window_0/prodB_2_4] [get_bd_pins five_sums_0/prodB_2_4s]
connect_bd_net [get_bd_pins mult_window_0/prodA_11_5] [get_bd_pins five_sums_0/prodA_11_5s]
connect_bd_net [get_bd_pins mult_window_0/prodA_12_5] [get_bd_pins five_sums_0/prodA_12_5s]
connect_bd_net [get_bd_pins mult_window_0/prodA_22_5] [get_bd_pins five_sums_0/prodA_22_5s]
connect_bd_net [get_bd_pins mult_window_0/prodB_1_5] [get_bd_pins five_sums_0/prodB_1_5s]
connect_bd_net [get_bd_pins mult_window_0/prodB_2_5] [get_bd_pins five_sums_0/prodB_2_5s]
connect_bd_net [get_bd_pins mult_window_0/prodA_11_6] [get_bd_pins five_sums_0/prodA_11_6s]
connect_bd_net [get_bd_pins mult_window_0/prodA_12_6] [get_bd_pins five_sums_0/prodA_12_6s]
connect_bd_net [get_bd_pins mult_window_0/prodA_22_6] [get_bd_pins five_sums_0/prodA_22_6s]
connect_bd_net [get_bd_pins mult_window_0/prodB_1_6] [get_bd_pins five_sums_0/prodB_1_6s]
connect_bd_net [get_bd_pins mult_window_0/prodB_2_6] [get_bd_pins five_sums_0/prodB_2_6s]
connect_bd_net [get_bd_pins mult_window_0/prodA_11_7] [get_bd_pins five_sums_0/prodA_11_7s]
connect_bd_net [get_bd_pins mult_window_0/prodA_12_7] [get_bd_pins five_sums_0/prodA_12_7s]
connect_bd_net [get_bd_pins mult_window_0/prodA_22_7] [get_bd_pins five_sums_0/prodA_22_7s]
connect_bd_net [get_bd_pins mult_window_0/prodB_1_7] [get_bd_pins five_sums_0/prodB_1_7s]
connect_bd_net [get_bd_pins mult_window_0/prodB_2_7] [get_bd_pins five_sums_0/prodB_2_7s]
connect_bd_net [get_bd_pins mult_window_0/prodA_11_8] [get_bd_pins five_sums_0/prodA_11_8s]
connect_bd_net [get_bd_pins mult_window_0/prodA_12_8] [get_bd_pins five_sums_0/prodA_12_8s]
connect_bd_net [get_bd_pins mult_window_0/prodA_22_8] [get_bd_pins five_sums_0/prodA_22_8s]
connect_bd_net [get_bd_pins mult_window_0/prodB_1_8] [get_bd_pins five_sums_0/prodB_1_8s]
connect_bd_net [get_bd_pins mult_window_0/prodB_2_8] [get_bd_pins five_sums_0/prodB_2_8s]
connect_bd_net [get_bd_pins mult_window_0/prodA_11_9] [get_bd_pins five_sums_0/prodA_11_9s]
connect_bd_net [get_bd_pins mult_window_0/prodA_12_9] [get_bd_pins five_sums_0/prodA_12_9s]
connect_bd_net [get_bd_pins mult_window_0/prodA_22_9] [get_bd_pins five_sums_0/prodA_22_9s]
connect_bd_net [get_bd_pins mult_window_0/prodB_1_9] [get_bd_pins five_sums_0/prodB_1_9s]
connect_bd_net [get_bd_pins mult_window_0/prodB_2_9] [get_bd_pins five_sums_0/prodB_2_9s]
connect_bd_net [get_bd_pins mult_window_0/prodA_11_10] [get_bd_pins five_sums_0/prodA_11_10s]
connect_bd_net [get_bd_pins mult_window_0/prodA_12_10] [get_bd_pins five_sums_0/prodA_12_10s]
connect_bd_net [get_bd_pins mult_window_0/prodA_22_10] [get_bd_pins five_sums_0/prodA_22_10s]
connect_bd_net [get_bd_pins mult_window_0/prodB_1_10] [get_bd_pins five_sums_0/prodB_1_10s]
connect_bd_net [get_bd_pins mult_window_0/prodB_2_10] [get_bd_pins five_sums_0/prodB_2_10s]
connect_bd_net [get_bd_pins mult_window_0/prodA_11_11] [get_bd_pins five_sums_0/prodA_11_11s]
connect_bd_net [get_bd_pins mult_window_0/prodA_12_11] [get_bd_pins five_sums_0/prodA_12_11s]
connect_bd_net [get_bd_pins mult_window_0/prodA_22_11] [get_bd_pins five_sums_0/prodA_22_11s]
connect_bd_net [get_bd_pins mult_window_0/prodB_1_11] [get_bd_pins five_sums_0/prodB_1_11s]
connect_bd_net [get_bd_pins mult_window_0/prodB_2_11] [get_bd_pins five_sums_0/prodB_2_11s]
connect_bd_net [get_bd_pins mult_window_0/prodA_11_12] [get_bd_pins five_sums_0/prodA_11_12s]
connect_bd_net [get_bd_pins mult_window_0/prodA_12_12] [get_bd_pins five_sums_0/prodA_12_12s]
connect_bd_net [get_bd_pins mult_window_0/prodA_22_12] [get_bd_pins five_sums_0/prodA_22_12s]
connect_bd_net [get_bd_pins mult_window_0/prodB_1_12] [get_bd_pins five_sums_0/prodB_1_12s]
connect_bd_net [get_bd_pins mult_window_0/prodB_2_12] [get_bd_pins five_sums_0/prodB_2_12s]
connect_bd_net [get_bd_pins five_sums_0/sum_a_11] [get_bd_pins sum_a_11_FIFO/din] [get_bd_pins final_sum_0/sum_a_11]
connect_bd_net [get_bd_pins five_sums_0/sum_a_12] [get_bd_pins sum_a_12_FIFO/din] [get_bd_pins final_sum_0/sum_a_12]
connect_bd_net [get_bd_pins five_sums_0/sum_a_22] [get_bd_pins sum_a_22_FIFO/din] [get_bd_pins final_sum_0/sum_a_22]
connect_bd_net [get_bd_pins five_sums_0/sum_b_1] [get_bd_pins sum_b_1_FIFO/din] [get_bd_pins final_sum_0/sum_b_1]
connect_bd_net [get_bd_pins five_sums_0/sum_b_2] [get_bd_pins sum_b_2_FIFO/din] [get_bd_pins final_sum_0/sum_b_2]
connect_bd_net [get_bd_pins sum_b_2_FIFO/dout] [get_bd_pins final_sum_0/prev_b_2]
connect_bd_net [get_bd_pins sum_b_1_FIFO/dout] [get_bd_pins final_sum_0/prev_b_1]
connect_bd_net [get_bd_pins sum_a_11_FIFO/dout] [get_bd_pins final_sum_0/prev_a_11]
connect_bd_net [get_bd_pins sum_a_12_FIFO/dout] [get_bd_pins final_sum_0/prev_a_12]
connect_bd_net [get_bd_pins sum_a_22_FIFO/dout] [get_bd_pins final_sum_0/prev_a_22]
connect_bd_net [get_bd_pins final_sum_0/a_11] [get_bd_pins Shift_Inv_0/A_11] [get_bd_pins Calc_Denom_0/A_11]
connect_bd_net [get_bd_pins final_sum_0/a_12] [get_bd_pins Shift_Inv_0/A_12] [get_bd_pins Calc_Denom_0/A_12]
connect_bd_net [get_bd_pins final_sum_0/a_22] [get_bd_pins Shift_Inv_0/A_22] [get_bd_pins Calc_Denom_0/A_22]
connect_bd_net [get_bd_pins Shift_Inv_0/A_11_shift] [get_bd_pins div_gen_0/s_axis_dividend_tdata]
connect_bd_net [get_bd_pins Calc_Denom_0/denom] \
  [get_bd_pins div_gen_0/s_axis_divisor_tdata] [get_bd_pins div_gen_1/s_axis_divisor_tdata] \
  [get_bd_pins div_gen_2/s_axis_divisor_tdata]
connect_bd_net [get_bd_pins final_sum_0/b_1] [get_bd_pins delay_16_clks/B_1]
connect_bd_net [get_bd_pins final_sum_0/b_2] [get_bd_pins delay_16_clks/B_2]
connect_bd_net -net delay_0_B_1_del [get_bd_pins delay_16_clks/B_1_del] [get_bd_pins Result_0/B_1]
connect_bd_net -net delay_0_B_2_del [get_bd_pins delay_16_clks/B_2_del] [get_bd_pins Result_0/B_2]
connect_bd_net -net clk_1 [get_bd_ports clk_in] \
  [get_bd_pins sum_b_2_FIFO/clk] [get_bd_pins sum_b_1_FIFO/clk] [get_bd_pins sum_a_22_FIFO/clk] \
  [get_bd_pins sum_a_12_FIFO/clk] [get_bd_pins sum_a_11_FIFO/clk] [get_bd_pins line10/clk] [get_bd_pins line9/clk] \
  [get_bd_pins line8/clk] [get_bd_pins line4/clk] [get_bd_pins line7/clk] [get_bd_pins line12/clk] [get_bd_pins line1/clk] \
  [get_bd_pins line2/clk] [get_bd_pins line11/clk] [get_bd_pins line3/clk] [get_bd_pins line5/clk] [get_bd_pins line6/clk] \
  [get_bd_pins line0/clk] [get_bd_pins next1/clk] [get_bd_pins next2/clk] [get_bd_pins next3/clk] [get_bd_pins next4/clk] \
  [get_bd_pins next5/clk] [get_bd_pins next6/clk] [get_bd_pins next7/clk] [get_bd_pins next8/clk] [get_bd_pins next9/clk] \
  [get_bd_pins next10/clk] [get_bd_pins div_gen_2/aclk] [get_bd_pins div_gen_1/aclk] [get_bd_pins div_gen_0/aclk] \
  [get_bd_pins next11/clk] [get_bd_pins fifo_generator_0/clk] [get_bd_pins fifo_generator_1/clk] [get_bd_pins line_buf_0/clk] \
  [get_bd_pins line_buf_1/clk] [get_bd_pins line_buf_2/clk] [get_bd_pins line_buf_3/clk] [get_bd_pins line_buf_4/clk] \
  [get_bd_pins line_buf_5/clk] [get_bd_pins line_buf_6/clk] [get_bd_pins line_buf_12/clk] [get_bd_pins line_buf_7/clk] \
  [get_bd_pins line_buf_8/clk] [get_bd_pins line_buf_9/clk] [get_bd_pins line_buf_10/clk] [get_bd_pins line_buf_11/clk] \
  [get_bd_pins line_buf_13/clk] [get_bd_pins line_buf_14/clk] [get_bd_pins line_buf_23/clk] [get_bd_pins line_buf_15/clk] \
  [get_bd_pins line_buf_16/clk] [get_bd_pins line_buf_17/clk] [get_bd_pins line_buf_18/clk] [get_bd_pins line_buf_19/clk] \
  [get_bd_pins line_buf_20/clk] [get_bd_pins line_buf_21/clk] [get_bd_pins line_buf_22/clk] [get_bd_pins mult_window_0/clk] \
  [get_bd_pins final_sum_0/clk] [get_bd_pins delay_16_clks/clk] [get_bd_pins Shift_Inv_0/clk] [get_bd_pins Calc_Denom_0/clk] \
  [get_bd_pins LineBufCtrl_0/clk] [get_bd_pins LineBufCtrl_1/clk] [get_bd_pins LineBufCtrl_2/clk] \
  [get_bd_pins LineBufCtrl_3/clk] [get_bd_pins LineBufCtrl_4/clk] [get_bd_pins LineBufCtrl_5/clk] \
  [get_bd_pins LineBufCtrl_6/clk] [get_bd_pins LineBufCtrl_7/clk] [get_bd_pins LineBufCtrl_8/clk] \
  [get_bd_pins LineBufCtrl_9/clk] [get_bd_pins LineBufCtrl_18/clk] [get_bd_pins LineBufCtrl_19/clk] \
  [get_bd_pins LineBufCtrl_20/clk] [get_bd_pins LineBufCtrl_10/clk] [get_bd_pins LineBufCtrl_11/clk] \
  [get_bd_pins LineBufCtrl_12/clk] [get_bd_pins LineBufCtrl_13/clk] [get_bd_pins LineBufCtrl_14/clk] \
  [get_bd_pins LineBufCtrl_15/clk] [get_bd_pins LineBufCtrl_16/clk] [get_bd_pins LineBufCtrl_17/clk] \
  [get_bd_pins LineBufCtrl_21/clk] [get_bd_pins flop_0/clk] [get_bd_pins flop_1/clk] [get_bd_pins deriv_window_0/clk] \
  [get_bd_pins five_sums_0/clk] [get_bd_pins Result_0/clk] [get_bd_pins control_0/clk]
connect_bd_net [get_bd_pins line_buf_12/middle] [get_bd_pins deriv_window_0/m_13]
connect_bd_net [get_bd_pins line_buf_11/middle] [get_bd_pins deriv_window_0/m_12]
connect_bd_net [get_bd_pins line_buf_11/right] [get_bd_pins deriv_window_0/r_12]
connect_bd_net [get_bd_pins line_buf_10/middle] [get_bd_pins deriv_window_0/m_11]
connect_bd_net [get_bd_pins line_buf_10/right] [get_bd_pins deriv_window_0/r_11]
connect_bd_net [get_bd_pins line_buf_9/middle] [get_bd_pins deriv_window_0/m_10]
connect_bd_net [get_bd_pins line_buf_9/right] [get_bd_pins deriv_window_0/r_10]
connect_bd_net [get_bd_pins line_buf_8/middle] [get_bd_pins deriv_window_0/m_9]
connect_bd_net [get_bd_pins line_buf_8/right] [get_bd_pins deriv_window_0/r_9]
connect_bd_net [get_bd_pins line_buf_7/middle] [get_bd_pins deriv_window_0/m_8]
connect_bd_net [get_bd_pins line_buf_7/right] [get_bd_pins deriv_window_0/r_8]
connect_bd_net [get_bd_pins line_buf_6/middle] [get_bd_pins deriv_window_0/m_7]
connect_bd_net [get_bd_pins line_buf_6/right] [get_bd_pins deriv_window_0/r_7]
connect_bd_net [get_bd_pins line_buf_5/middle] [get_bd_pins deriv_window_0/m_6]
connect_bd_net [get_bd_pins line_buf_5/right] [get_bd_pins deriv_window_0/r_6]
connect_bd_net [get_bd_pins line_buf_4/middle] [get_bd_pins deriv_window_0/m_5]
connect_bd_net [get_bd_pins line_buf_4/right] [get_bd_pins deriv_window_0/r_5]
connect_bd_net [get_bd_pins line_buf_3/middle] [get_bd_pins deriv_window_0/m_4]
connect_bd_net [get_bd_pins line_buf_3/right] [get_bd_pins deriv_window_0/r_4]
connect_bd_net [get_bd_pins line_buf_2/middle] [get_bd_pins deriv_window_0/m_3]
connect_bd_net [get_bd_pins line_buf_2/right] [get_bd_pins deriv_window_0/r_3]
connect_bd_net [get_bd_pins line_buf_1/middle] [get_bd_pins deriv_window_0/m_2]
connect_bd_net [get_bd_pins line_buf_1/right] [get_bd_pins deriv_window_0/r_2]
connect_bd_net [get_bd_pins line_buf_0/middle] [get_bd_pins deriv_window_0/m_1]
connect_bd_net -net reset_1 [get_bd_ports reset_rtl_0] \
  [get_bd_pins fifo_generator_0/srst] [get_bd_pins fifo_generator_1/srst] [get_bd_pins line_buf_0/reset] \
  [get_bd_pins line_buf_1/reset] [get_bd_pins line_buf_2/reset] [get_bd_pins line_buf_3/reset] [get_bd_pins line_buf_4/reset] \
  [get_bd_pins line_buf_5/reset] [get_bd_pins line_buf_6/reset] [get_bd_pins line_buf_12/reset] \
  [get_bd_pins line_buf_7/reset] [get_bd_pins line_buf_8/reset] [get_bd_pins line_buf_9/reset] \
  [get_bd_pins line_buf_10/reset] [get_bd_pins line_buf_11/reset] [get_bd_pins line_buf_13/reset] \
  [get_bd_pins line_buf_14/reset] [get_bd_pins line_buf_23/reset] [get_bd_pins line_buf_15/reset] \
  [get_bd_pins line_buf_16/reset] [get_bd_pins line_buf_17/reset] [get_bd_pins line_buf_18/reset] \
  [get_bd_pins line_buf_19/reset] [get_bd_pins line_buf_20/reset] [get_bd_pins line_buf_21/reset] \
  [get_bd_pins line_buf_22/reset] [get_bd_pins mult_window_0/reset] [get_bd_pins delay_16_clks/reset] \
  [get_bd_pins Shift_Inv_0/reset] [get_bd_pins orGate_0/b] [get_bd_pins orGate_1/b] [get_bd_pins Calc_Denom_0/reset] \
  [get_bd_pins LineBufCtrl_0/reset] [get_bd_pins LineBufCtrl_1/reset] [get_bd_pins LineBufCtrl_2/reset] \
  [get_bd_pins LineBufCtrl_3/reset] [get_bd_pins LineBufCtrl_4/reset] [get_bd_pins LineBufCtrl_5/reset] \
  [get_bd_pins LineBufCtrl_6/reset] [get_bd_pins LineBufCtrl_7/reset] [get_bd_pins LineBufCtrl_8/reset] \
  [get_bd_pins LineBufCtrl_9/reset] [get_bd_pins LineBufCtrl_18/reset] [get_bd_pins LineBufCtrl_19/reset] \
  [get_bd_pins LineBufCtrl_20/reset] [get_bd_pins LineBufCtrl_10/reset] [get_bd_pins LineBufCtrl_11/reset] \
  [get_bd_pins LineBufCtrl_12/reset] [get_bd_pins LineBufCtrl_13/reset] [get_bd_pins LineBufCtrl_14/reset] \
  [get_bd_pins LineBufCtrl_15/reset] [get_bd_pins LineBufCtrl_16/reset] [get_bd_pins LineBufCtrl_17/reset] \
  [get_bd_pins LineBufCtrl_21/reset] [get_bd_pins flop_0/reset] [get_bd_pins flop_1/reset] [get_bd_pins deriv_window_0/reset] \
  [get_bd_pins five_sums_0/reset] [get_bd_pins Result_0/reset] [get_bd_pins control_0/reset_l]
connect_bd_net [get_bd_pins Result_0/u] [get_bd_pins fifo_generator_0/din]
connect_bd_net [get_bd_pins div_gen_0/m_axis_dout_tdata] [get_bd_pins Result_0/A_11_inv]
connect_bd_net [get_bd_pins div_gen_2/m_axis_dout_tdata] [get_bd_pins Result_0/A_22_inv]
connect_bd_net [get_bd_pins div_gen_1/m_axis_dout_tdata] [get_bd_pins Result_0/A_12_inv]
connect_bd_net [get_bd_pins Shift_Inv_0/A_12_shift] [get_bd_pins div_gen_1/s_axis_dividend_tdata]
connect_bd_net [get_bd_pins Shift_Inv_0/A_22_shift] [get_bd_pins div_gen_2/s_axis_dividend_tdata]
connect_bd_net -net divide_valid_1 [get_bd_pins Shift_Inv_0/valid] \
  [get_bd_pins div_gen_2/s_axis_dividend_tvalid] [get_bd_pins div_gen_2/s_axis_divisor_tvalid] \
  [get_bd_pins div_gen_1/s_axis_dividend_tvalid] [get_bd_pins div_gen_1/s_axis_divisor_tvalid] \
  [get_bd_pins div_gen_0/s_axis_dividend_tvalid] [get_bd_pins div_gen_0/s_axis_divisor_tvalid]
connect_bd_net [get_bd_pins next10/dout] [get_bd_pins next9/din] [get_bd_pins line_buf_23/in_val]
connect_bd_net [get_bd_pins next9/dout] [get_bd_pins next8/din] [get_bd_pins line_buf_22/in_val]
connect_bd_net [get_bd_pins next8/dout] [get_bd_pins next7/din] [get_bd_pins line_buf_21/in_val]
connect_bd_net [get_bd_pins next7/dout] [get_bd_pins next6/din] [get_bd_pins line_buf_20/in_val]
connect_bd_net [get_bd_pins next6/dout] [get_bd_pins next5/din] [get_bd_pins line_buf_19/in_val]
connect_bd_net [get_bd_pins next5/dout] [get_bd_pins next4/din] [get_bd_pins line_buf_18/in_val]
connect_bd_net [get_bd_pins next4/dout] [get_bd_pins next3/din] [get_bd_pins line_buf_17/in_val]
connect_bd_net [get_bd_pins next3/dout] [get_bd_pins next2/din] [get_bd_pins line_buf_16/in_val]
connect_bd_net [get_bd_pins next2/dout] [get_bd_pins next1/din] [get_bd_pins line_buf_15/in_val]
connect_bd_net [get_bd_pins next1/dout] [get_bd_pins next11/din] [get_bd_pins line_buf_14/in_val]
connect_bd_net [get_bd_pins line_buf_11/left] [get_bd_pins deriv_window_0/l_12]
connect_bd_net [get_bd_pins line_buf_10/left] [get_bd_pins deriv_window_0/l_11]
connect_bd_net [get_bd_pins line_buf_9/left] [get_bd_pins deriv_window_0/l_10]
connect_bd_net [get_bd_pins line_buf_8/left] [get_bd_pins deriv_window_0/l_9]
connect_bd_net [get_bd_pins line_buf_7/left] [get_bd_pins deriv_window_0/l_8]
connect_bd_net [get_bd_pins line_buf_6/left] [get_bd_pins deriv_window_0/l_7]
connect_bd_net [get_bd_pins line_buf_5/left] [get_bd_pins deriv_window_0/l_6]
connect_bd_net [get_bd_pins line_buf_4/left] [get_bd_pins deriv_window_0/l_5]
connect_bd_net [get_bd_pins line_buf_3/left] [get_bd_pins deriv_window_0/l_4]
connect_bd_net [get_bd_pins line_buf_2/left] [get_bd_pins deriv_window_0/l_3]
connect_bd_net [get_bd_pins line_buf_1/left] [get_bd_pins deriv_window_0/l_2]
connect_bd_net [get_bd_pins line_buf_23/middle] [get_bd_pins deriv_window_0/n_12]
connect_bd_net [get_bd_pins line_buf_22/middle] [get_bd_pins deriv_window_0/n_11]
connect_bd_net [get_bd_pins line_buf_21/middle] [get_bd_pins deriv_window_0/n_10]
connect_bd_net [get_bd_pins line_buf_20/middle] [get_bd_pins deriv_window_0/n_9]
connect_bd_net [get_bd_pins line_buf_19/middle] [get_bd_pins deriv_window_0/n_8]
connect_bd_net [get_bd_pins line_buf_18/middle] [get_bd_pins deriv_window_0/n_7]
connect_bd_net [get_bd_pins line_buf_17/middle] [get_bd_pins deriv_window_0/n_6]
connect_bd_net [get_bd_pins line_buf_16/middle] [get_bd_pins deriv_window_0/n_5]
connect_bd_net [get_bd_pins line_buf_15/middle] [get_bd_pins deriv_window_0/n_4]
connect_bd_net [get_bd_pins line_buf_14/middle] [get_bd_pins deriv_window_0/n_3]
connect_bd_net [get_bd_pins line_buf_13/middle] [get_bd_pins deriv_window_0/n_2]
connect_bd_net [get_bd_pins line12/dout] [get_bd_pins line11/din] [get_bd_pins line_buf_12/in_val]
connect_bd_net [get_bd_pins line11/dout] [get_bd_pins line10/din] [get_bd_pins line_buf_11/in_val]
connect_bd_net [get_bd_pins line10/dout] [get_bd_pins line9/din] [get_bd_pins line_buf_10/in_val]
connect_bd_net [get_bd_pins line9/dout] [get_bd_pins line8/din] [get_bd_pins line_buf_9/in_val]
connect_bd_net [get_bd_pins line8/dout] [get_bd_pins line7/din] [get_bd_pins line_buf_8/in_val]
connect_bd_net [get_bd_pins line7/dout] [get_bd_pins line6/din] [get_bd_pins line_buf_7/in_val]
connect_bd_net [get_bd_pins line6/dout] [get_bd_pins line5/din] [get_bd_pins line_buf_6/in_val]
connect_bd_net [get_bd_pins line5/dout] [get_bd_pins line4/din] [get_bd_pins line_buf_5/in_val]
connect_bd_net [get_bd_pins line4/dout] [get_bd_pins line3/din] [get_bd_pins line_buf_4/in_val]
connect_bd_net [get_bd_pins line3/dout] [get_bd_pins line2/din] [get_bd_pins line_buf_3/in_val]
connect_bd_net [get_bd_pins line2/dout] [get_bd_pins line1/din] [get_bd_pins line_buf_2/in_val]
connect_bd_net [get_bd_pins line1/dout] [get_bd_pins line0/din] [get_bd_pins line_buf_1/in_val]
connect_bd_net [get_bd_pins line0/dout] [get_bd_pins line_buf_0/in_val]
connect_bd_net [get_bd_pins next10/empty] [get_bd_pins LineBufCtrl_0/prev_empty]
connect_bd_net [get_bd_pins next9/empty] [get_bd_pins LineBufCtrl_1/prev_empty]
connect_bd_net [get_bd_pins next8/empty] [get_bd_pins LineBufCtrl_2/prev_empty]
connect_bd_net [get_bd_pins next7/empty] [get_bd_pins LineBufCtrl_3/prev_empty]
connect_bd_net [get_bd_pins next6/empty] [get_bd_pins LineBufCtrl_4/prev_empty]
connect_bd_net [get_bd_pins next5/empty] [get_bd_pins LineBufCtrl_5/prev_empty]
connect_bd_net [get_bd_pins next4/empty] [get_bd_pins LineBufCtrl_6/prev_empty]
connect_bd_net [get_bd_pins next3/empty] [get_bd_pins LineBufCtrl_7/prev_empty]
connect_bd_net [get_bd_pins next2/empty] [get_bd_pins LineBufCtrl_8/prev_empty]
connect_bd_net [get_bd_pins line12/empty] [get_bd_pins LineBufCtrl_13/prev_empty]
connect_bd_net [get_bd_pins line11/empty] [get_bd_pins LineBufCtrl_11/prev_empty]
connect_bd_net [get_bd_pins line10/empty] [get_bd_pins LineBufCtrl_16/prev_empty]
connect_bd_net [get_bd_pins line9/empty] [get_bd_pins LineBufCtrl_12/prev_empty]
connect_bd_net [get_bd_pins line8/empty] [get_bd_pins LineBufCtrl_9/prev_empty]
connect_bd_net [get_bd_pins line7/empty] [get_bd_pins LineBufCtrl_10/prev_empty]
connect_bd_net [get_bd_pins line6/empty] [get_bd_pins LineBufCtrl_17/prev_empty]
connect_bd_net [get_bd_pins line5/empty] [get_bd_pins LineBufCtrl_14/prev_empty]
connect_bd_net [get_bd_pins line4/empty] [get_bd_pins LineBufCtrl_15/prev_empty]
connect_bd_net [get_bd_pins line3/empty] [get_bd_pins LineBufCtrl_20/prev_empty]
connect_bd_net [get_bd_pins line2/empty] [get_bd_pins LineBufCtrl_19/prev_empty]
connect_bd_net [get_bd_pins line1/empty] [get_bd_pins LineBufCtrl_18/prev_empty]
connect_bd_net [get_bd_pins next1/empty] [get_bd_pins LineBufCtrl_21/prev_empty]
connect_bd_net [get_bd_pins next11/dout] [get_bd_pins line_buf_13/in_val]
connect_bd_net [get_bd_pins control_0/FIFO_rd] \
  [get_bd_pins sum_b_2_FIFO/rd_en] [get_bd_pins sum_b_1_FIFO/rd_en] [get_bd_pins sum_a_22_FIFO/rd_en] \
  [get_bd_pins sum_a_12_FIFO/rd_en] [get_bd_pins sum_a_11_FIFO/rd_en]
connect_bd_net [get_bd_pins control_0/subtract] [get_bd_pins final_sum_0/subtract]
connect_bd_net [get_bd_pins next10/full] [get_bd_pins control_0/n_line_buf_full]
connect_bd_net [get_bd_pins control_0/FIFO_wr] \
  [get_bd_pins sum_b_2_FIFO/wr_en] [get_bd_pins sum_b_1_FIFO/wr_en] [get_bd_pins sum_a_22_FIFO/wr_en] \
  [get_bd_pins sum_a_12_FIFO/wr_en] [get_bd_pins sum_a_11_FIFO/wr_en]
connect_bd_net [get_bd_pins control_0/FF_en] \
  [get_bd_pins line_buf_0/FF_en] [get_bd_pins line_buf_1/FF_en] [get_bd_pins line_buf_2/FF_en] [get_bd_pins line_buf_3/FF_en] \
  [get_bd_pins line_buf_4/FF_en] [get_bd_pins line_buf_5/FF_en] [get_bd_pins line_buf_6/FF_en] \
  [get_bd_pins line_buf_12/FF_en] [get_bd_pins line_buf_7/FF_en] [get_bd_pins line_buf_8/FF_en] \
  [get_bd_pins line_buf_9/FF_en] [get_bd_pins line_buf_10/FF_en] [get_bd_pins line_buf_11/FF_en] \
  [get_bd_pins line_buf_13/FF_en] [get_bd_pins line_buf_14/FF_en] [get_bd_pins line_buf_23/FF_en] \
  [get_bd_pins line_buf_15/FF_en] [get_bd_pins line_buf_16/FF_en] [get_bd_pins line_buf_17/FF_en] \
  [get_bd_pins line_buf_18/FF_en] [get_bd_pins line_buf_19/FF_en] [get_bd_pins line_buf_20/FF_en] \
  [get_bd_pins line_buf_21/FF_en] [get_bd_pins line_buf_22/FF_en] [get_bd_pins LineBufCtrl_0/FF_en] \
  [get_bd_pins LineBufCtrl_1/FF_en] [get_bd_pins LineBufCtrl_2/FF_en] [get_bd_pins LineBufCtrl_3/FF_en] \
  [get_bd_pins LineBufCtrl_4/FF_en] [get_bd_pins LineBufCtrl_5/FF_en] [get_bd_pins LineBufCtrl_6/FF_en] \
  [get_bd_pins LineBufCtrl_7/FF_en] [get_bd_pins LineBufCtrl_8/FF_en] [get_bd_pins LineBufCtrl_9/FF_en] \
  [get_bd_pins LineBufCtrl_18/FF_en] [get_bd_pins LineBufCtrl_19/FF_en] [get_bd_pins LineBufCtrl_20/FF_en] \
  [get_bd_pins LineBufCtrl_10/FF_en] [get_bd_pins LineBufCtrl_11/FF_en] [get_bd_pins LineBufCtrl_12/FF_en] \
  [get_bd_pins LineBufCtrl_13/FF_en] [get_bd_pins LineBufCtrl_14/FF_en] [get_bd_pins LineBufCtrl_15/FF_en] \
  [get_bd_pins LineBufCtrl_16/FF_en] [get_bd_pins LineBufCtrl_17/FF_en] [get_bd_pins LineBufCtrl_21/FF_en] \
  [get_bd_pins flop_0/d] [get_bd_pins flop_1/d]
connect_bd_net [get_bd_pins control_0/FIFO_clear] [get_bd_pins orGate_0/a]
connect_bd_net [get_bd_pins orGate_0/c] \
  [get_bd_pins sum_b_2_FIFO/srst] [get_bd_pins sum_a_11_FIFO/srst] [get_bd_pins sum_b_1_FIFO/srst] \
  [get_bd_pins sum_a_22_FIFO/srst] [get_bd_pins sum_a_12_FIFO/srst] [get_bd_pins final_sum_0/reset]
connect_bd_net [get_bd_ports img] [get_bd_pins line12/din]
connect_bd_net [get_bd_ports nxt_img] [get_bd_pins next10/din]
connect_bd_net [get_bd_pins fifo_generator_0/empty] [get_bd_ports u_empty]
connect_bd_net [get_bd_pins fifo_generator_1/empty] [get_bd_ports v_empty]
connect_bd_net [get_bd_pins Result_0/v] [get_bd_pins fifo_generator_1/din]
connect_bd_net [get_bd_pins fifo_generator_1/dout] [get_bd_ports v_out]
connect_bd_net [get_bd_pins fifo_generator_0/dout] [get_bd_ports u_out]
connect_bd_net [get_bd_pins control_0/data_valid] [get_bd_pins fifo_generator_1/wr_en] [get_bd_pins fifo_generator_0/wr_en]
connect_bd_net [get_bd_ports u_rd] [get_bd_pins fifo_generator_0/rd_en]
connect_bd_net [get_bd_ports v_rd] [get_bd_pins fifo_generator_1/rd_en]
connect_bd_net [get_bd_ports nxt_img_wr_en] [get_bd_pins next10/wr_en]
connect_bd_net [get_bd_ports img_wr_en] [get_bd_pins line12/wr_en]
connect_bd_net [get_bd_pins LineBufCtrl_13/wr] [get_bd_pins line11/wr_en]
connect_bd_net [get_bd_pins LineBufCtrl_13/rd] [get_bd_pins line12/rd_en]
connect_bd_net [get_bd_pins LineBufCtrl_11/wr] [get_bd_pins line10/wr_en]
connect_bd_net [get_bd_pins LineBufCtrl_11/rd] [get_bd_pins line11/rd_en]
connect_bd_net [get_bd_pins LineBufCtrl_16/rd] [get_bd_pins line10/rd_en]
connect_bd_net [get_bd_pins LineBufCtrl_16/wr] [get_bd_pins line9/wr_en]
connect_bd_net [get_bd_pins LineBufCtrl_12/rd] [get_bd_pins line9/rd_en]
connect_bd_net [get_bd_pins LineBufCtrl_12/wr] [get_bd_pins line8/wr_en]
connect_bd_net [get_bd_pins LineBufCtrl_9/rd] [get_bd_pins line8/rd_en]
connect_bd_net [get_bd_pins LineBufCtrl_9/wr] [get_bd_pins line7/wr_en]
connect_bd_net [get_bd_pins LineBufCtrl_10/rd] [get_bd_pins line7/rd_en]
connect_bd_net [get_bd_pins LineBufCtrl_10/wr] [get_bd_pins line6/wr_en]
connect_bd_net [get_bd_pins LineBufCtrl_17/rd] [get_bd_pins line6/rd_en]
connect_bd_net [get_bd_pins LineBufCtrl_17/wr] [get_bd_pins line5/wr_en]
connect_bd_net [get_bd_pins LineBufCtrl_14/rd] [get_bd_pins line5/rd_en]
connect_bd_net [get_bd_pins LineBufCtrl_14/wr] [get_bd_pins line4/wr_en]
connect_bd_net [get_bd_pins LineBufCtrl_15/rd] [get_bd_pins line4/rd_en]
connect_bd_net [get_bd_pins LineBufCtrl_15/wr] [get_bd_pins line3/wr_en]
connect_bd_net [get_bd_pins LineBufCtrl_20/rd] [get_bd_pins line3/rd_en]
connect_bd_net [get_bd_pins LineBufCtrl_20/wr] [get_bd_pins line2/wr_en]
connect_bd_net [get_bd_pins LineBufCtrl_19/rd] [get_bd_pins line2/rd_en]
connect_bd_net [get_bd_pins LineBufCtrl_19/wr] [get_bd_pins line1/wr_en]
connect_bd_net [get_bd_pins LineBufCtrl_18/rd] [get_bd_pins line1/rd_en]
connect_bd_net [get_bd_pins LineBufCtrl_18/wr] [get_bd_pins line0/wr_en]
connect_bd_net [get_bd_pins LineBufCtrl_0/rd] [get_bd_pins next10/rd_en]
connect_bd_net [get_bd_pins LineBufCtrl_0/wr] [get_bd_pins next9/wr_en]
connect_bd_net [get_bd_pins LineBufCtrl_1/rd] [get_bd_pins next9/rd_en]
connect_bd_net [get_bd_pins LineBufCtrl_1/wr] [get_bd_pins next8/wr_en]
connect_bd_net [get_bd_pins LineBufCtrl_2/rd] [get_bd_pins next8/rd_en]
connect_bd_net [get_bd_pins LineBufCtrl_2/wr] [get_bd_pins next7/wr_en]
connect_bd_net [get_bd_pins LineBufCtrl_3/rd] [get_bd_pins next7/rd_en]
connect_bd_net [get_bd_pins LineBufCtrl_3/wr] [get_bd_pins next6/wr_en]
connect_bd_net [get_bd_pins LineBufCtrl_4/rd] [get_bd_pins next6/rd_en]
connect_bd_net [get_bd_pins LineBufCtrl_4/wr] [get_bd_pins next5/wr_en]
connect_bd_net [get_bd_pins LineBufCtrl_5/rd] [get_bd_pins next5/rd_en]
connect_bd_net [get_bd_pins LineBufCtrl_5/wr] [get_bd_pins next4/wr_en]
connect_bd_net [get_bd_pins LineBufCtrl_6/rd] [get_bd_pins next4/rd_en]
connect_bd_net [get_bd_pins LineBufCtrl_6/wr] [get_bd_pins next3/wr_en]
connect_bd_net [get_bd_pins LineBufCtrl_7/rd] [get_bd_pins next3/rd_en]
connect_bd_net [get_bd_pins LineBufCtrl_7/wr] [get_bd_pins next2/wr_en]
connect_bd_net [get_bd_pins LineBufCtrl_8/rd] [get_bd_pins next2/rd_en]
connect_bd_net [get_bd_pins LineBufCtrl_8/wr] [get_bd_pins next1/wr_en]
connect_bd_net [get_bd_pins LineBufCtrl_21/rd] [get_bd_pins next1/rd_en]
connect_bd_net [get_bd_pins LineBufCtrl_21/wr] [get_bd_pins next11/wr_en]
connect_bd_net [get_bd_pins orGate_1/c] \
  [get_bd_pins line10/srst] [get_bd_pins line11/srst] [get_bd_pins line12/srst] [get_bd_pins line9/srst] \
  [get_bd_pins line8/srst] [get_bd_pins line7/srst] [get_bd_pins line6/srst] [get_bd_pins line5/srst] \
  [get_bd_pins line4/srst] [get_bd_pins line3/srst] [get_bd_pins line2/srst] [get_bd_pins line1/srst] \
  [get_bd_pins line0/srst] [get_bd_pins next10/srst] [get_bd_pins next9/srst] [get_bd_pins next8/srst] \
  [get_bd_pins next7/srst] [get_bd_pins next6/srst] [get_bd_pins next5/srst] [get_bd_pins next4/srst] \
  [get_bd_pins next3/srst] [get_bd_pins next2/srst] [get_bd_pins next1/srst] [get_bd_pins next11/srst]
connect_bd_net [get_bd_pins control_0/clean_FIFOs] [get_bd_pins orGate_1/a]
connect_bd_net [get_bd_pins line11/almost_full] [get_bd_pins LineBufCtrl_13/this_full]
connect_bd_net [get_bd_pins line10/almost_full] [get_bd_pins LineBufCtrl_11/this_full]
connect_bd_net [get_bd_pins line9/almost_full] [get_bd_pins LineBufCtrl_16/this_full]
connect_bd_net [get_bd_pins line8/almost_full] [get_bd_pins LineBufCtrl_12/this_full]
connect_bd_net [get_bd_pins line7/almost_full] [get_bd_pins LineBufCtrl_9/this_full]
connect_bd_net [get_bd_pins line6/almost_full] [get_bd_pins LineBufCtrl_10/this_full]
connect_bd_net [get_bd_pins line5/almost_full] [get_bd_pins LineBufCtrl_17/this_full]
connect_bd_net [get_bd_pins line4/almost_full] [get_bd_pins LineBufCtrl_14/this_full]
connect_bd_net [get_bd_pins line3/almost_full] [get_bd_pins LineBufCtrl_15/this_full]
connect_bd_net [get_bd_pins line2/almost_full] [get_bd_pins LineBufCtrl_20/this_full]
connect_bd_net [get_bd_pins line1/almost_full] [get_bd_pins LineBufCtrl_19/this_full]
connect_bd_net [get_bd_pins line0/almost_full] [get_bd_pins LineBufCtrl_18/this_full]
connect_bd_net [get_bd_pins next9/almost_full] [get_bd_pins LineBufCtrl_0/this_full]
connect_bd_net [get_bd_pins next8/almost_full] [get_bd_pins LineBufCtrl_1/this_full]
connect_bd_net [get_bd_pins next7/almost_full] [get_bd_pins LineBufCtrl_2/this_full]
connect_bd_net [get_bd_pins next6/almost_full] [get_bd_pins LineBufCtrl_3/this_full]
connect_bd_net [get_bd_pins next5/almost_full] [get_bd_pins LineBufCtrl_4/this_full]
connect_bd_net [get_bd_pins next4/almost_full] [get_bd_pins LineBufCtrl_5/this_full]
connect_bd_net [get_bd_pins next3/almost_full] [get_bd_pins LineBufCtrl_6/this_full]
connect_bd_net [get_bd_pins next2/almost_full] [get_bd_pins LineBufCtrl_7/this_full]
connect_bd_net [get_bd_pins next1/almost_full] [get_bd_pins LineBufCtrl_8/this_full]
connect_bd_net [get_bd_pins next11/almost_full] [get_bd_pins LineBufCtrl_21/this_full]
connect_bd_net [get_bd_pins flop_0/q] [get_bd_pins line0/rd_en]
connect_bd_net [get_bd_pins flop_1/q] [get_bd_pins next11/rd_en]
connect_bd_net [get_bd_pins line12/almost_full] [get_bd_ports img_full]
connect_bd_net [get_bd_pins next10/almost_full] [get_bd_ports nxt_img_full]
connect_bd_net [get_bd_pins line12/full] [get_bd_pins control_0/line_buf_full]

validate_bd_design
save_bd_design
